# Altium project Gould.PrjPCB (part 1 of 2)
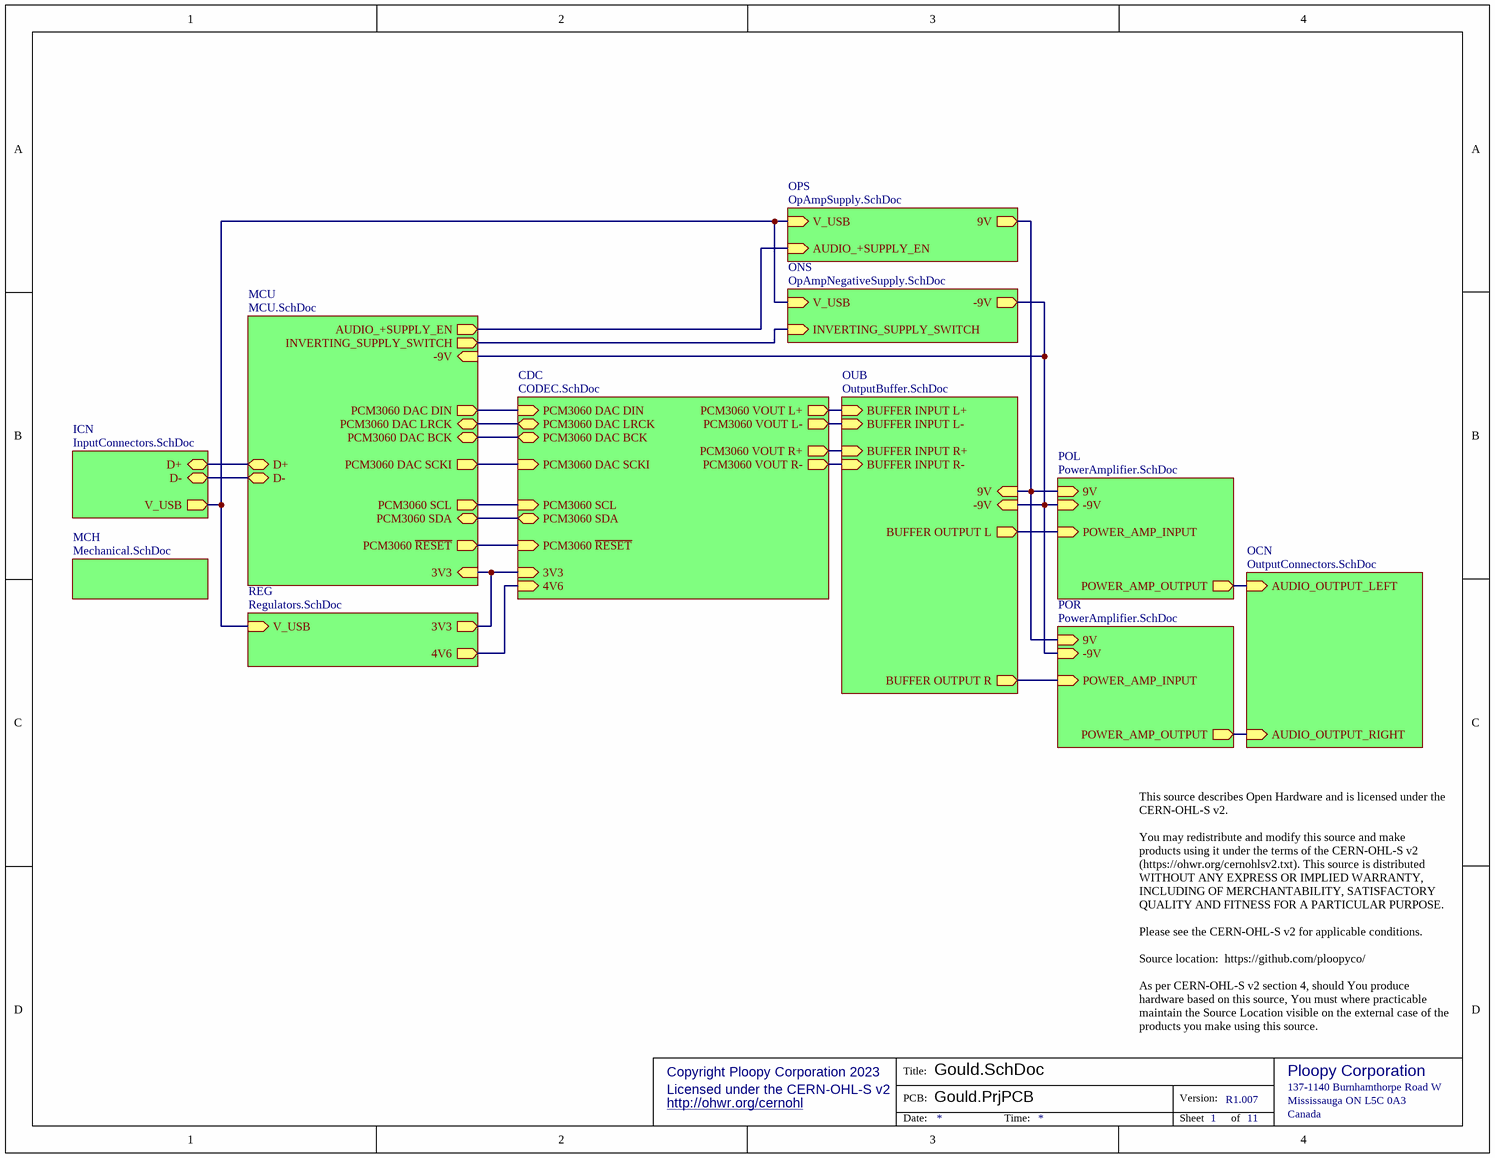
[diagram p0: Gould.SchDoc]
11 sheets, 155 parts. Net scope: hierarchical (ports join the sheet entries above them; power ports are global).
Board file: Gould.PcbDoc
Sheets:
  Gould.SchDoc
    ICN = InputConnectors.SchDoc
    MCH = Mechanical.SchDoc
    OPS = OpAmpSupply.SchDoc
    OCN = OutputConnectors.SchDoc
    POL = PowerAmplifier.SchDoc
    POR = PowerAmplifier.SchDoc
    MCU = MCU.SchDoc
    CDC = CODEC.SchDoc
    REG = Regulators.SchDoc
    OUB = OutputBuffer.SchDoc
    ONS = OpAmpNegativeSupply.SchDoc

## Sheet Gould.SchDoc
size Letter; CompanyName: Ploopy Corporation; Organization: Ploopy Corporation; Address1: Suite 226, 137-1140 Burnhamthorpe Road W; Address2: Mississauga; Address3: Ontario; Address4: Canada L5C 0A3; DocumentNumber: 1; Revision: R1.007; SheetNumber: 1; SheetTotal: 11

### Sub-sheets
CDC = CODEC.SchDoc: PCM3060 DAC DIN (in), PCM3060 SDA (bidir), PCM3060 DAC LRCK (bidir), PCM3060 VOUT L+ (out), PCM3060 VOUT R+ (out), PCM3060 SCL (in), PCM3060 DAC BCK (bidir), PCM3060 ~{RESET} (in), 3V3 (in), 4V6 (in), PCM3060 VOUT L- (out), PCM3060 VOUT R- (out), PCM3060 DAC SCKI (in)
ICN = InputConnectors.SchDoc: V_USB (out), D+ (bidir), D- (bidir)
MCH = Mechanical.SchDoc: no entries
MCU = MCU.SchDoc: D+ (bidir), D- (bidir), 3V3 (in), PCM3060 DAC DIN (out), PCM3060 SDA (bidir), PCM3060 DAC LRCK (bidir), PCM3060 SCL (out), PCM3060 DAC BCK (bidir), PCM3060 ~{RESET} (out), INVERTING_SUPPLY_SWITCH (out), -9V (in), PCM3060 DAC SCKI (out), AUDIO_+SUPPLY_EN (out)
OCN = OutputConnectors.SchDoc: AUDIO_OUTPUT_LEFT (in), AUDIO_OUTPUT_RIGHT (in)
ONS = OpAmpNegativeSupply.SchDoc: V_USB (in), -9V (out), INVERTING_SUPPLY_SWITCH (in)
OPS = OpAmpSupply.SchDoc: V_USB (in), 9V (out), AUDIO_+SUPPLY_EN (in)
OUB = OutputBuffer.SchDoc: -9V (in), 9V (in), BUFFER OUTPUT R (out), BUFFER INPUT R- (in), BUFFER INPUT R+ (in), BUFFER INPUT L- (in), BUFFER OUTPUT L (out), BUFFER INPUT L+ (in)
POL = PowerAmplifier.SchDoc: POWER_AMP_INPUT (in), POWER_AMP_OUTPUT (out), -9V (in), 9V (in)
POR = PowerAmplifier.SchDoc: POWER_AMP_INPUT (in), POWER_AMP_OUTPUT (out), -9V (in), 9V (in)
REG = Regulators.SchDoc: 3V3 (out), V_USB (in), 4V6 (out)

### Nets
3V3: sheet MCU/3V3, sheet CDC/3V3, sheet REG/3V3
4V6: sheet CDC/4V6, sheet REG/4V6
9V: sheet OPS/9V, sheet POL/9V, sheet POR/9V, sheet OUB/9V
-9V: sheet POL/-9V, sheet POR/-9V, sheet MCU/-9V, sheet OUB/-9V, sheet ONS/-9V
NetC3_2: sheet POR/POWER_AMP_INPUT, sheet OUB/BUFFER OUTPUT R
NetC8_2: sheet ICN/V_USB, sheet OPS/V_USB, sheet REG/V_USB, sheet ONS/V_USB
NetC9_2: sheet POL/POWER_AMP_INPUT, sheet OUB/BUFFER OUTPUT L
NetD2_1: sheet OCN/AUDIO_OUTPUT_RIGHT, sheet POR/POWER_AMP_OUTPUT
NetD2_2: sheet OCN/AUDIO_OUTPUT_LEFT, sheet POL/POWER_AMP_OUTPUT
NetFB4_2: sheet ICN/D-, sheet MCU/D-
NetFB5_2: sheet ICN/D+, sheet MCU/D+
NetQ1_G: sheet MCU/INVERTING_SUPPLY_SWITCH, sheet ONS/INVERTING_SUPPLY_SWITCH
NetR1_2: sheet OPS/AUDIO_+SUPPLY_EN, sheet MCU/AUDIO_+SUPPLY_EN
NetRa1_3: sheet MCU/PCM3060 SDA, sheet CDC/PCM3060 SDA
NetRa1_4: sheet MCU/PCM3060 SCL, sheet CDC/PCM3060 SCL
NetRa4_1: sheet CDC/PCM3060 VOUT L+, sheet OUB/BUFFER INPUT L+
NetRa4_2: sheet CDC/PCM3060 VOUT L-, sheet OUB/BUFFER INPUT L-
NetRa4_3: sheet CDC/PCM3060 VOUT R+, sheet OUB/BUFFER INPUT R+
NetRa4_4: sheet CDC/PCM3060 VOUT R-, sheet OUB/BUFFER INPUT R-
NetU10_9: sheet MCU/PCM3060 DAC SCKI, sheet CDC/PCM3060 DAC SCKI
NetU10_10: sheet MCU/PCM3060 DAC BCK, sheet CDC/PCM3060 DAC BCK
NetU10_11: sheet MCU/PCM3060 DAC LRCK, sheet CDC/PCM3060 DAC LRCK
NetU10_12: sheet MCU/PCM3060 DAC DIN, sheet CDC/PCM3060 DAC DIN
NetU10_15: sheet MCU/PCM3060 ~{RESET}, sheet CDC/PCM3060 ~{RESET}

### Notes on the sheet
- This source describes Open Hardware and is licensed under the CERN-OHL-S v2.
  You may redistribute and modify this source and make products using it under the terms of the CERN-OHL-S v2 (https://ohwr.org/cernohlsv2.txt). This source is distributed WITHOUT ANY EXPRESS OR IMPLIED WARRANTY, INCLUDING OF MERCHANTABILITY, SATISFACTORY QUALITY AND FITNESS FOR A PARTICULAR PURPOSE.
  Please see the CERN-OHL-S v2 for applicable conditions.
  Source location:  https://github.com/ploopyco/
  As per CERN-OHL-S v2 section 4, should You produce hardware based on this source, You must where practicable maintain the Source Location visible on the external case of the products you make using this source.
- Copyright Ploopy Corporation 2023
- Licensed under the CERN-OHL-S v2
- http://ohwr.org/cernohl
- Title:
- PCB:
- Version:
- Ploopy Corporation
- Mississauga ON L5C 0A3
- 137-1140 Burnhamthorpe Road W
- Date:
- Time:
- Sheet
- of
- Canada

## Sheet InputConnectors.SchDoc
size Letter; CompanyName: Ploopy Corporation; Organization: Ploopy Corporation; Address1: Suite 226, 137-1140 Burnhamthorpe Road W; Address2: Mississauga; Address3: Ontario; Address4: Canada L5C 0A3; DocumentNumber: 3; Revision: R1.007; SheetNumber: 3; SheetTotal: 11
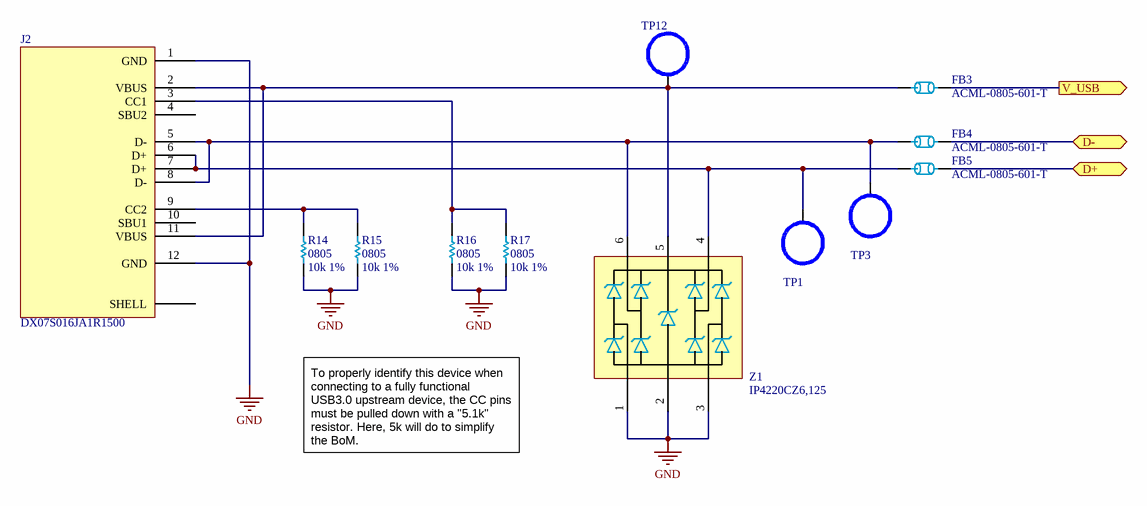
[diagram p1: InputConnectors.SchDoc]

### Parts
FB3  ACML-0805-601-T  [0805]
FB4  ACML-0805-601-T  [0805]
FB5  ACML-0805-601-T  [0805]
J2  DX07S016JA1R1500  [DX07S016JA1R1500]
R14  0805  value 10k 1%  [0805]
R15  0805  value 10k 1%  [0805]
R16  0805  value 10k 1%  [0805]
R17  0805  value 10k 1%  [0805]
TP1  TestPointHook  [S2751-46R]  (value not drawn)
TP3  TestPointHook  [S2751-46R]  (value not drawn)
TP12  TestPointHook  [S2751-46R]  (value not drawn)
Z1  IP4220CZ6,125  [PESD3V3S4UD - SOT95P275X110-6N]

### Ports
D+ (bidir), D- (bidir), V_USB (out)

### Nets
GND: J2.1(GND) J2.12(GND) R14.1 R15.1 R16.1 R17.1 Z1.1 Z1.2 Z1.3
NetC8_2: FB3.2 ; port V_USB
NetFB3_1: FB3.1 J2.2(VBUS) J2.11(VBUS) TP12.1 Z1.5
NetFB4_1: FB4.1 J2.5(D-) J2.8(D-) TP3.1 Z1.6
NetFB4_2: FB4.2 ; port D-
NetFB5_1: FB5.1 J2.6(D+) J2.7(D+) TP1.1 Z1.4
NetFB5_2: FB5.2 ; port D+
NetJ2_3: J2.3(CC1) R16.2 R17.2
NetJ2_9: J2.9(CC2) R14.2 R15.2

Not connected (* = marked no-connect by the designer): J2 4(SBU2) 10(SBU1) SHELL

### Notes on the sheet
- To properly identify this device when connecting to a fully functional USB3.0 upstream device, the CC pins must be pulled down with a "5.1k" resistor. Here, 5k will do to simplify the BoM.
- Copyright Ploopy Corporation 2023
- Licensed under the CERN-OHL-S v2
- http://ohwr.org/cernohl
- Title:
- PCB:
- Version:
- Ploopy Corporation
- Mississauga ON L5C 0A3
- 137-1140 Burnhamthorpe Road W
- Date:
- Time:
- Sheet
- of
- Canada

### Library data of the parts
FB3-FB5 = ACML-0805-601-T: FERRITE BEAD 600 OHM 0805 1LN; PNP-Nzl: 2; PNP-dx: 0; PNP-X: 2.00; PNP-Y: 1.25; PNP-Thk: 0.55; PNP-Lv: 1; PNP-TS: 70; PNP-Type: chi; PNP-FeedType: Tape; PNP-TapeWidth: 8; PNP-dy: 0; PNP-Pt: 0; PNP-W: 0; PNP-Level: 1; PNP-Voff: 0; PNP-PlacePriority: 1; PNP-A: 0; PNP-TapeIndex: 1; PNP-da: 0; Supplier 1: Digi-Key; Supplier Part Number 1: 535-12556-1-ND
J2 = DX07S016JA1R1500: USB-C (USB TYPE-C) USB 2.0 Receptacle Connector 24 (16+8 Dummy) Position Surface Mount, Right Angle; Through Hole; Supplier 1: Digi-Key; Supplier 2: Mouser; Supplier Part Number 1: 670-DX07S016JA1R1500CT-ND; Supplier Part Number 2: 656-DX07S016JA1R1500
R14-R17 = Res 10k 1% 0805: Chip resistor; Supplier 1: Digi-Key; Supplier Part Number 1: RMCF0805FT10K0TR-ND
TP1 TP3 TP12 = TestPointHook: Test point, SMT ring (micro-hook compatible); Supplier 1: Digi-Key; Supplier Part Number 1: 952-2664-6-ND; Supplier 2: Digi-Key; Supplier Part Number 2: A106144DKR-ND; Supplier 3: Arrow; Supplier Part Number 3: z_4zPAhGJpPHHYBcC24zmONEz5elv0VZALWfNkICq0w
Z1 = IP4220CZ6,125: TVS DIODE 5.5V 6TSOP (Low capacitance, USB); PNP-Nzl: 2; PNP-dx: 0; PNP-X: 2.9; PNP-Y: 1.3; PNP-A: 270; PNP-Thk: 1; PNP-Lv: 26; PNP-TS: 90; PNP-Type: CHP; PNP-FeedType: Tape; PNP-TapeWidth: 8; PNP-PlacePriority: 3; PNP-dy: 0; PNP-Pt: 0; PNP-W: 0; PNP-Level: 1; PNP-Voff: 0; PNP-TapeIndex: 1; PNP-da: 0

## Sheet Mechanical.SchDoc
size Letter; CompanyName: Ploopy Corporation; Organization: Ploopy Corporation; Address1: Suite 226, 137-1140 Burnhamthorpe Road W; Address2: Mississauga; Address3: Ontario; Address4: Canada L5C 0A3; DocumentNumber: 5; Revision: R1.007; SheetNumber: 5; SheetTotal: 11
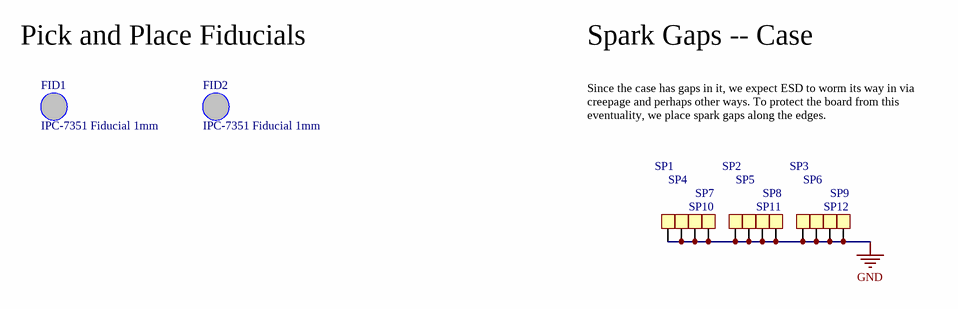
[diagram p2: Mechanical.SchDoc]

### Parts
FID1  IPC-7351 Fiducial 1mm  [FIDUCIAL_1.5]
FID2  IPC-7351 Fiducial 1mm  [FIDUCIAL_1.5]
SP1  Spark Gap  [SparkGap]  (value not drawn)  (no BOM)
SP2  Spark Gap  [SparkGap]  (value not drawn)  (no BOM)
SP3  Spark Gap  [SparkGap]  (value not drawn)  (no BOM)
SP4  Spark Gap  [SparkGap]  (value not drawn)  (no BOM)
SP5  Spark Gap  [SparkGap]  (value not drawn)  (no BOM)
SP6  Spark Gap  [SparkGap]  (value not drawn)  (no BOM)
SP7  Spark Gap  [SparkGap]  (value not drawn)  (no BOM)
SP8  Spark Gap  [SparkGap]  (value not drawn)  (no BOM)
SP9  Spark Gap  [SparkGap]  (value not drawn)  (no BOM)
SP10  Spark Gap  [SparkGap]  (value not drawn)  (no BOM)
SP11  Spark Gap  [SparkGap]  (value not drawn)  (no BOM)
SP12  Spark Gap  [SparkGap]  (value not drawn)  (no BOM)

### Nets
GND: SP1.1 SP2.1 SP3.1 SP4.1 SP5.1 SP6.1 SP7.1 SP8.1 SP9.1 SP10.1 SP11.1 SP12.1

Not connected (* = marked no-connect by the designer): FID1 1; FID2 1

### Notes on the sheet
- Pick and Place Fiducials
- Spark Gaps -- Case
- Since the case has gaps in it, we expect ESD to worm its way in via creepage and perhaps other ways. To protect the board from this eventuality, we place spark gaps along the edges.
- Copyright Ploopy Corporation 2023
- Licensed under the CERN-OHL-S v2
- http://ohwr.org/cernohl
- Title:
- PCB:
- Version:
- Ploopy Corporation
- Mississauga ON L5C 0A3
- 137-1140 Burnhamthorpe Road W
- Date:
- Time:
- Sheet
- of
- Canada

### Library data of the parts
FID1 FID2 = FIDUCIAL_1.5: PNP-Nzl: 2; PNP-dx: 0; PNP-X: 4; PNP-A: 1; PNP-Thk: 1.02; PNP-TS: 70; PNP-Type: MARK1; PNP-dy: 0; PNP-Y: 4; PNP-Pt: 0; PNP-W: 0; PNP-Lv: 1; PNP-Level: 1; PNP-Voff: 0; PNP-FeedType: Fiducial; PNP-TapeWidth: 0; PNP-PlacePriority: 0; PNP-TapeIndex: 0; PNP-da: 0
SP1-SP12 = Spark Gap: Open square pad for spark gapping; PNP-Nzl: 2; PNP-dx: 0; PNP-X: 1; PNP-TS: 70; PNP-Type: CHI; PNP-FeedType: Tape; PNP-TapeWidth: 8; PNP-dy: 0; PNP-Y: 1; PNP-A: 0; PNP-Pt: 0; PNP-W: 0; PNP-Thk: 1; PNP-Lv: 1; PNP-Level: 1; PNP-Voff: 0; PNP-PlacePriority: 1; PNP-TapeIndex: 1; PNP-da: 0

## Sheet OpAmpSupply.SchDoc
size Legal; CompanyName: Ploopy Corporation; Organization: Ploopy Corporation; Address1: Suite 226, 137-1140 Burnhamthorpe Road W; Address2: Mississauga; Address3: Ontario; Address4: Canada L5C 0A3; DocumentNumber: 7; Revision: R1.007; SheetNumber: 7; SheetTotal: 11
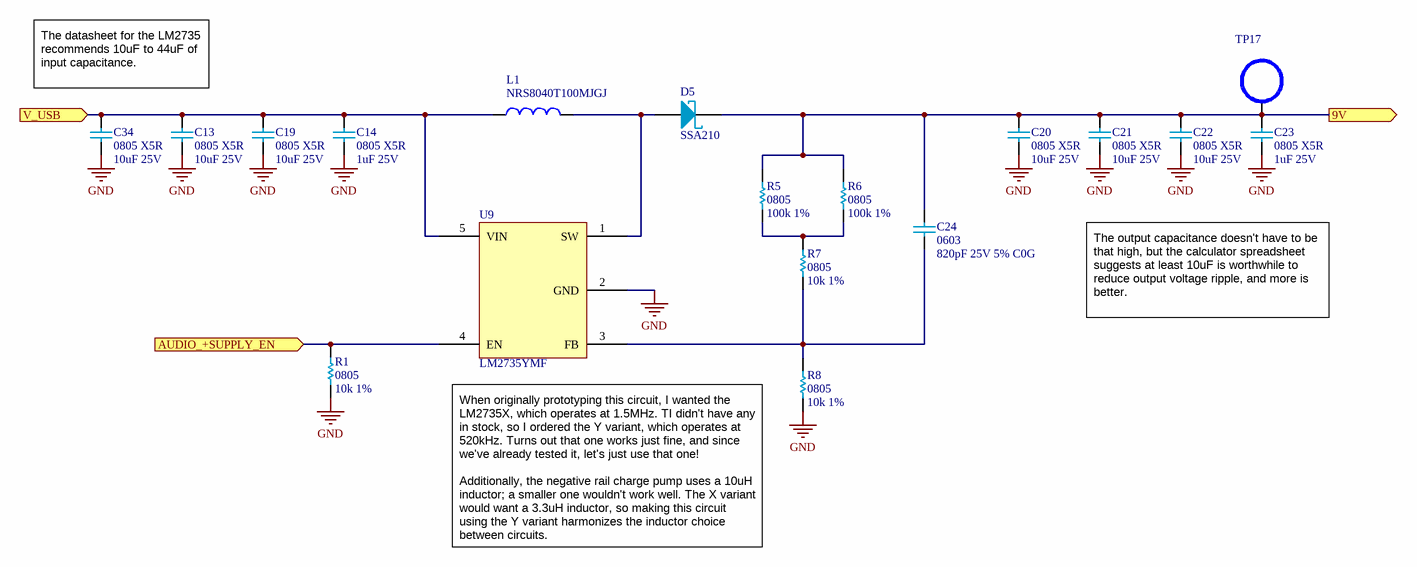
[diagram p3: OpAmpSupply.SchDoc]

### Parts
C13  0805 X5R  value 10uF 25V  [0805 - TALL]
C14  0805 X5R  value 1uF 25V  [0805 - TALL]
C19  0805 X5R  value 10uF 25V  [0805 - TALL]
C20  0805 X5R  value 10uF 25V  [0805 - TALL]
C21  0805 X5R  value 10uF 25V  [0805 - TALL]
C22  0805 X5R  value 10uF 25V  [0805 - TALL]
C23  0805 X5R  value 1uF 25V  [0805 - TALL]
C24  0603  value 820pF 25V 5% C0G  [0603]
C34  0805 X5R  value 10uF 25V  [0805 - TALL]
D5  SSA210  [SSA210 - DO-214AC]
L1  NRS8040T100MJGJ  [NRS8040T100MJGJ]
R1  0805  value 10k 1%  [0805]
R5  0805  value 100k 1%  [0805]
R6  0805  value 100k 1%  [0805]
R7  0805  value 10k 1%  [0805]
R8  0805  value 10k 1%  [0805]
TP17  TestPointHook  [S2751-46R]  (value not drawn)
U9  LM2735YMF  [LM2735XMF - SOT95P280X145-5M]

### Ports
9V (out), AUDIO_+SUPPLY_EN (in), V_USB (in)

### Nets
GND: C13.1 C14.1 C19.1 C20.1 C21.1 C22.1 C23.1 C34.1 R1.1 R8.1 U9.2(GND)
9V: C20.2 C21.2 C22.2 C23.2 C24.2 D5.1(C) R5.2 R6.2 TP17.1 ; port 9V
NetC8_2: C13.2 C14.2 C19.2 C34.2 L1.1 U9.5(VIN) ; port V_USB
NetC24_1: C24.1 R7.1 R8.2 U9.3(FB)
NetD5_2: D5.2 L1.2 U9.1(SW)
NetR1_2: R1.2 U9.4(EN) ; port AUDIO_+SUPPLY_EN
NetR5_1: R5.1 R6.1 R7.2

### Notes on the sheet
- The datasheet for the LM2735 recommends 10uF to 44uF of input capacitance.
- The output capacitance doesn't have to be that high, but the calculator spreadsheet suggests at least 10uF is worthwhile to reduce output voltage ripple, and more is better.
- When originally prototyping this circuit, I wanted the LM2735X, which operates at 1.5MHz. TI didn't have any in stock, so I ordered the Y variant, which operates at 520kHz. Turns out that one works just fine, and since we've already tested it, let's just use that one!
  Additionally, the negative rail charge pump uses a 10uH inductor; a smaller one wouldn't work well. The X variant would want a 3.3uH inductor, so making this circuit using the Y variant harmonizes the inductor choice between circuits.
- Copyright Ploopy Corporation 2023
- Licensed under the CERN-OHL-S v2
- http://ohwr.org/cernohl
- Title:
- PCB:
- Version:
- Ploopy Corporation
- Mississauga ON L5C 0A3
- 137-1140 Burnhamthorpe Road W
- Date:
- Time:
- Sheet
- of
- Canada

### Library data of the parts
C13 C19-C22 C34 = Cap 10uF 25V: 0805, X5R or better; Supplier 1: Mouser; Supplier Part Number 1: 81-GRM21BR61E106KA3L; Supplier 2: Digi-Key; Supplier Part Number 2: 490-5523-1-ND
C14 C23 = Cap 1uF 25V: 0805, X5R or better; Supplier 1: Digi-Key; Supplier Part Number 1: 1276-1066-2-ND; Supplier 2: Digi-Key; Supplier Part Number 2: 1276-1066-1-ND
C24 = Cap 820pF 25V: 0603, 5% C0G or better
D5 = SSA210: 100V 2A Shottky Diode (Rectifier); Supplier 1: Mouser; Supplier Part Number 1: 512-SSA210; Supplier 2: Digi-Key; Supplier Part Number 2: SSA210CT-ND
L1 = NRS8040T100MJGJ: FIXED IND 10UH 3.1A 44.2MOHM SMD
R1 R7 R8 = Res 10k 1% 0805: Chip resistor; Supplier 1: Digi-Key; Supplier Part Number 1: RMCF0805FT10K0TR-ND
R5 R6 = Res 100k 1% 0805: Chip resistor; Supplier 1: Digi-Key; Supplier 2: Digi-Key; Supplier Part Number 1: RMCF0805FT100KTR-ND; Supplier Part Number 2: RMCF0805FT100KCT-ND
TP17 = TestPointHook: as TP1 on sheet InputConnectors; Supplier 1: Digi-Key; Supplier Part Number 1: 952-2664-6-ND; Supplier 2: Digi-Key; Supplier Part Number 2: A106144DKR-ND; Supplier 3: Arrow; Supplier Part Number 3: z_4zPAhGJpPHHYBcC24zmONEz5elv0VZALWfNkICq0w
U9 = LM2735YMF: LM2735 520-kHz Space-Efficient Boost and SEPIC DC/DC Regulator

## Sheet OutputConnectors.SchDoc
size Letter; CompanyName: Ploopy Corporation; Organization: Ploopy Corporation; Address1: Suite 226, 137-1140 Burnhamthorpe Road W; Address2: Mississauga; Address3: Ontario; Address4: Canada L5C 0A3; DocumentNumber: 9; Revision: R1.007; SheetNumber: 9; SheetTotal: 11
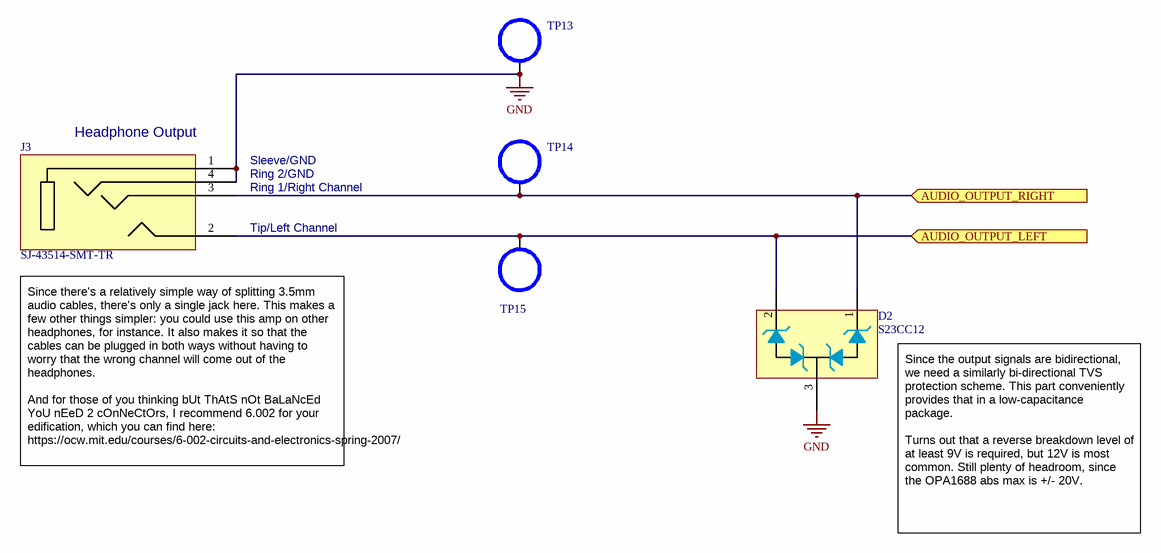
[diagram p4: OutputConnectors.SchDoc]

### Parts
D2  S23CC12  [S23CC12 - SOT90P240X110-3M]
J3  SJ-43514-SMT-TR  [SJ-43514-SMT-TR]
TP13  TestPointHook  [S2751-46R]  (value not drawn)
TP14  TestPointHook  [S2751-46R]  (value not drawn)
TP15  TestPointHook  [S2751-46R]  (value not drawn)

### Ports
AUDIO_OUTPUT_LEFT (in), AUDIO_OUTPUT_RIGHT (in)

### Nets
GND: D2.3 J3.1 J3.4 TP13.1
NetD2_1: D2.1 J3.3 TP14.1 ; port AUDIO_OUTPUT_RIGHT
NetD2_2: D2.2 J3.2 TP15.1 ; port AUDIO_OUTPUT_LEFT

### Notes on the sheet
- (near J3) Headphone Output
- Sleeve/GND
- Ring 2/GND
- Ring 1/Right Channel
- Tip/Left Channel
- (near J3) Since there's a relatively simple way of splitting 3.5mm audio cables, there's only a single jack here. This makes a few other things simpler: you could use this amp on other headphones, for instance. It also makes it so that the cables can be plugged in both ways without having to worry that the wrong channel will come out of the headphones.
  And for those of you thinking bUt ThAtS nOt BaLaNcEd YoU nEeD 2 cOnNeCtOrs, I recommend 6.002 for your edification, which you can find here: https://ocw.mit.edu/courses/6-002-circuits-and-electronics-spring-2007/
- (near D2) Since the output signals are bidirectional, we need a similarly bi-directional TVS protection scheme. This part conveniently provides that in a low-capacitance package.
  Turns out that a reverse breakdown level of at least 9V is required, but 12V is most common. Still plenty of headroom, since the OPA1688 abs max is +/- 20V.
- Copyright Ploopy Corporation 2023
- Licensed under the CERN-OHL-S v2
- http://ohwr.org/cernohl
- Title:
- PCB:
- Version:
- Ploopy Corporation
- Mississauga ON L5C 0A3
- 137-1140 Burnhamthorpe Road W
- Date:
- Time:
- Sheet
- of
- Canada

### Library data of the parts
D2 = S23CC12: 12V 2-CHANNEL LOW CAPACITANCE BI-DIRECTIONAL TVS ARRAY
J3 = SJ-43514-SMT-TR: 3.50mm (0.141", 1/8", Mini Plug) - Headphone Phone Jack Stereo (4 Conductor, TRRS) Connector Solder; Supplier 1: Digi-Key; Supplier 2: Mouser; Supplier Part Number 2: 490-SJ-43514-SMT-TR; Supplier Part Number 1: CP-43514SJCT-ND
TP13-TP15 = TestPointHook: as TP1 on sheet InputConnectors; Supplier 1: Digi-Key; Supplier Part Number 1: 952-2664-6-ND; Supplier 2: Digi-Key; Supplier Part Number 2: A106144DKR-ND; Supplier 3: Arrow; Supplier Part Number 3: z_4zPAhGJpPHHYBcC24zmONEz5elv0VZALWfNkICq0w

## Sheet PowerAmplifier.SchDoc
size Legal; CompanyName: Ploopy Corporation; Organization: Ploopy Corporation; Address1: Suite 226, 137-1140 Burnhamthorpe Road W; Address2: Mississauga; Address3: Ontario; Address4: Canada L5C 0A3; DocumentNumber: 10; Revision: R1.007; SheetNumber: 10; SheetTotal: 11
Used 2 times, as channels POL, POR. Parts and nets are listed once, with the designators drawn on the sheet.
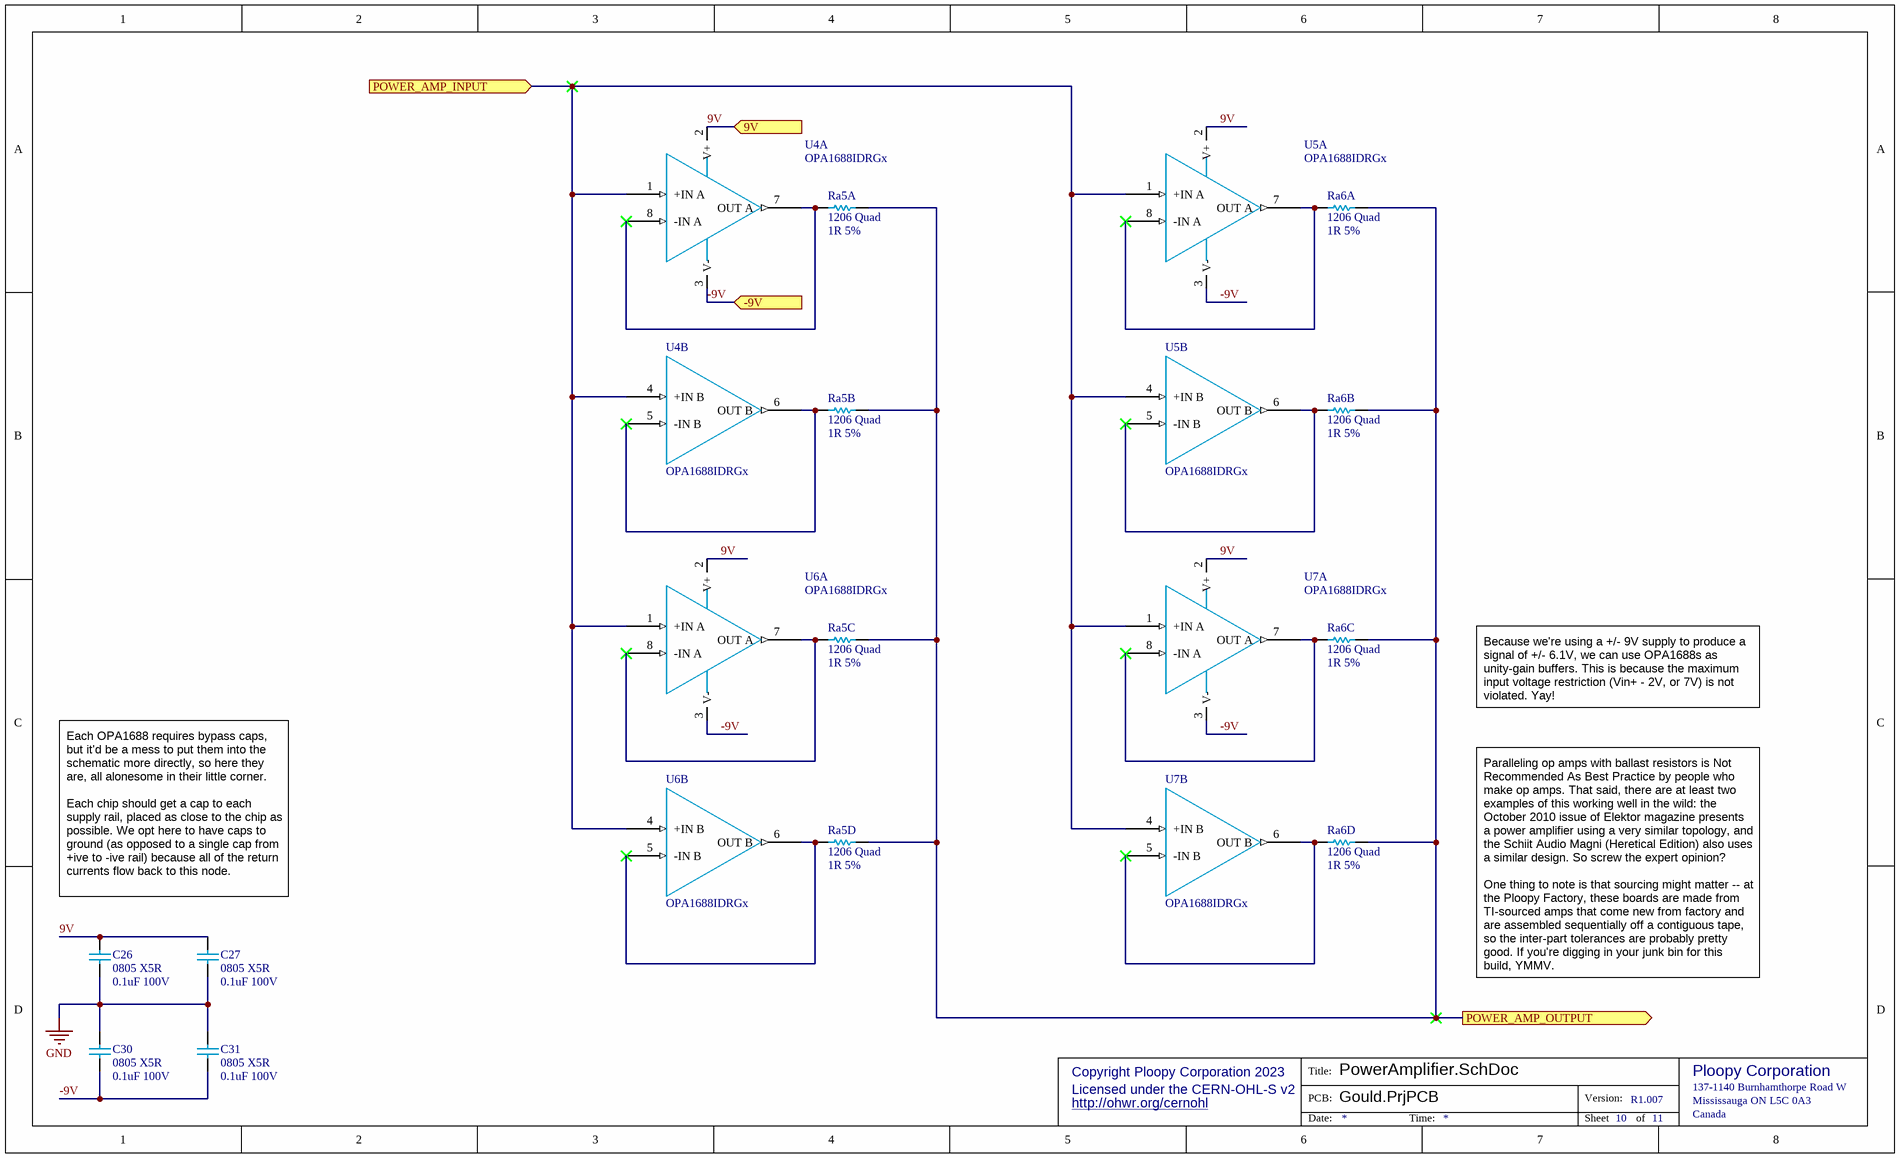
[diagram p5: PowerAmplifier.SchDoc]

### Parts
C26  0805 X5R  value 0.1uF 100V  [0805 - TALL]
C27  0805 X5R  value 0.1uF 100V  [0805 - TALL]
C30  0805 X5R  value 0.1uF 100V  [0805 - TALL]
C31  0805 X5R  value 0.1uF 100V  [0805 - TALL]
Ra5  1206 Quad  value 1R 5%  [4x 1R 5% - CAC-80P320X160-8M]  (parts A,B,C,D of 4)
Ra6  1206 Quad  value 1R 5%  [4x 1R 5% - CAC-80P320X160-8M]  (parts A,B,C,D of 4)
U4  OPA1688IDRGx  [OPA1688 - SON50P300X80_HS-9M]  (parts A,B of 2)
U5  OPA1688IDRGx  [OPA1688 - SON50P300X80_HS-9M]  (parts A,B of 2)
U6  OPA1688IDRGx  [OPA1688 - SON50P300X80_HS-9M]  (parts A,B of 2)
U7  OPA1688IDRGx  [OPA1688 - SON50P300X80_HS-9M]  (parts A,B of 2)

### Ports
9V (in), -9V (in), POWER_AMP_INPUT (in), POWER_AMP_OUTPUT (out)

### Nets
GND: C26.1 C27.1 C30.2 C31.2
9V: C26.2 C27.2 U4.2(V+) U5.2(V+) U6.2(V+) U7.2(V+) ; port 9V
-9V: C30.1 C31.1 U4.3(V-) U5.3(V-) U6.3(V-) U7.3(V-) ; port -9V
POWER_AMP_INPUT: U4.1(+IN_A) U4.4(+IN_B) U5.1(+IN_A) U5.4(+IN_B) U6.1(+IN_A) U6.4(+IN_B) U7.1(+IN_A) U7.4(+IN_B) ; port POWER_AMP_INPUT
POWER_AMP_OUTPUT: Ra5.5 Ra5.6 Ra5.7 Ra5.8 Ra6.5 Ra6.6 Ra6.7 Ra6.8 ; port POWER_AMP_OUTPUT
NetRa5_1: Ra5.1 U4.7(OUT_A) U4.8(-IN_A)
NetRa5_2: Ra5.2 U4.5(-IN_B) U4.6(OUT_B)
NetRa5_3: Ra5.3 U6.7(OUT_A) U6.8(-IN_A)
NetRa5_4: Ra5.4 U6.5(-IN_B) U6.6(OUT_B)
NetRa6_1: Ra6.1 U5.7(OUT_A) U5.8(-IN_A)
NetRa6_2: Ra6.2 U5.5(-IN_B) U5.6(OUT_B)
NetRa6_3: Ra6.3 U7.7(OUT_A) U7.8(-IN_A)
NetRa6_4: Ra6.4 U7.5(-IN_B) U7.6(OUT_B)

### Channels
POL: designators end in _POL; ports 9V=9V -9V=-9V POWER_AMP_INPUT=NetC9_2 POWER_AMP_OUTPUT=NetD2_2
POR: designators end in _POR; ports 9V=9V -9V=-9V POWER_AMP_INPUT=NetC3_2 POWER_AMP_OUTPUT=NetD2_1

### Notes on the sheet
- Because we're using a +/- 9V supply to produce a signal of +/- 6.1V, we can use OPA1688s as unity-gain buffers. This is because the maximum input voltage restriction (Vin+ - 2V, or 7V) is not violated. Yay!
- Each OPA1688 requires bypass caps, but it'd be a mess to put them into the schematic more directly, so here they are, all alonesome in their little corner.
  Each chip should get a cap to each supply rail, placed as close to the chip as possible. We opt here to have caps to ground (as opposed to a single cap from +ive to -ive rail) because all of the return currents flow back to this node.
- Paralleling op amps with ballast resistors is Not Recommended As Best Practice by people who make op amps. That said, there are at least two examples of this working well in the wild: the October 2010 issue of Elektor magazine presents a power amplifier using a very similar topology, and the Schiit Audio Magni (Heretical Edition) also uses a similar design. So screw the expert opinion?
  One thing to note is that sourcing might matter -- at the Ploopy Factory, these boards are made from TI-sourced amps that come new from factory and are assembled sequentially off a contiguous tape, so the inter-part tolerances are probably pretty good. If you're digging in your junk bin for this build, YMMV.
- Copyright Ploopy Corporation 2023
- Licensed under the CERN-OHL-S v2
- http://ohwr.org/cernohl
- Title:
- PCB:
- Version:
- Ploopy Corporation
- Mississauga ON L5C 0A3
- 137-1140 Burnhamthorpe Road W
- Date:
- Time:
- Sheet
- of
- Canada

### Library data of the parts
C26 C27 C30 C31 = Cap 0.1uF 100V: 0805, X5R or better; Supplier 1: Digi-Key; Supplier Part Number 1: 1276-6840-2-ND
Ra5 Ra6 = Quad Res 1R 5% 1206: Chip resistor
U4-U7 = OPA1688IDRGx: 36V, 10MHz, Low Distortion High Drive Rail-to-Rail Output Audio Operational Amplifiers; Supplier 1: Arrow Electronics; Supplier 2: Mouser; Supplier Part Number 2: 595-OPA1688IDRGR; Supplier Part Number 1: OPA1688IDRGR

## Sheet MCU.SchDoc
size Tabloid; CompanyName: Ploopy Corporation; Organization: Ploopy Corporation; Address1: Suite 226, 137-1140 Burnhamthorpe Road W; Address2: Mississauga; Address3: Ontario; Address4: Canada L5C 0A3; DocumentNumber: 4; Revision: R1.007; SheetNumber: 4; SheetTotal: 11
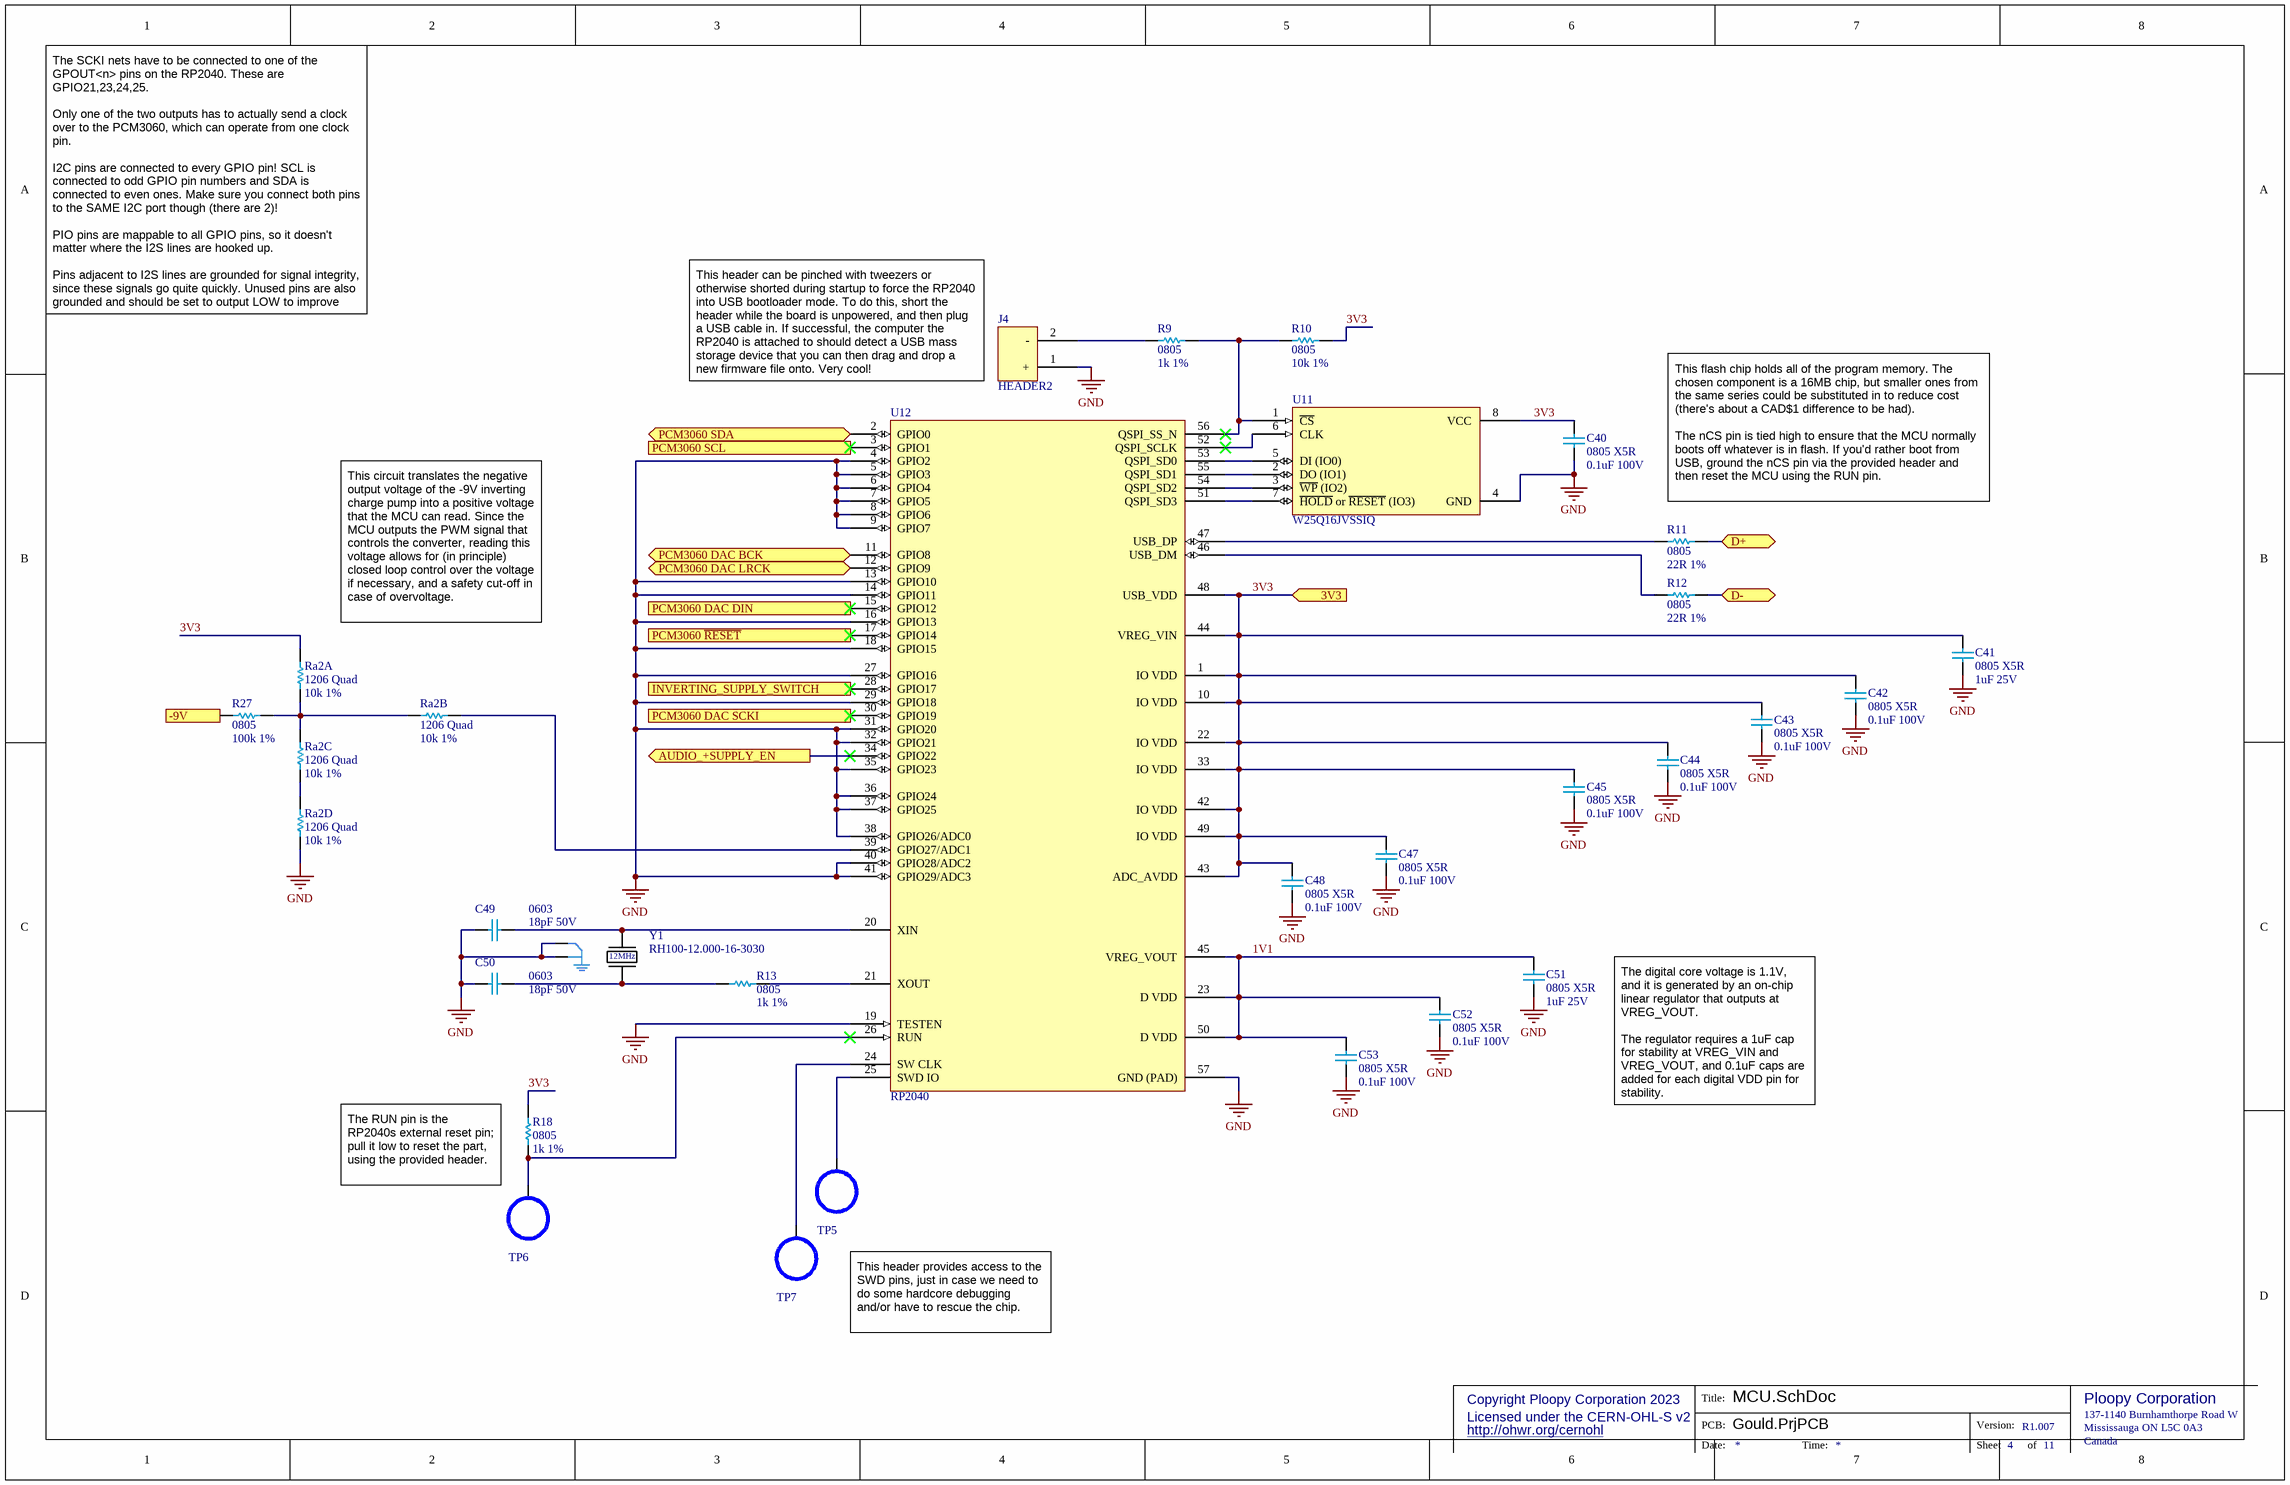
[diagram p6: MCU.SchDoc]

### Parts
C40  0805 X5R  value 0.1uF 100V  [0805 - TALL]
C41  0805 X5R  value 1uF 25V  [0805 - TALL]
C42  0805 X5R  value 0.1uF 100V  [0805 - TALL]
C43  0805 X5R  value 0.1uF 100V  [0805 - TALL]
C44  0805 X5R  value 0.1uF 100V  [0805 - TALL]
C45  0805 X5R  value 0.1uF 100V  [0805 - TALL]
C47  0805 X5R  value 0.1uF 100V  [0805 - TALL]
C48  0805 X5R  value 0.1uF 100V  [0805 - TALL]
C49  0603  value 18pF 50V  [0603]
C50  0603  value 18pF 50V  [0603]
C51  0805 X5R  value 1uF 25V  [0805 - TALL]
C52  0805 X5R  value 0.1uF 100V  [0805 - TALL]
C53  0805 X5R  value 0.1uF 100V  [0805 - TALL]
J4  HEADER2  [2x1]
R9  0805  value 1k 1%  [0805]
R10  0805  value 10k 1%  [0805]
R11  0805  value 22R 1%  [0805]
R12  0805  value 22R 1%  [0805]
R13  0805  value 1k 1%  [0805]
R18  0805  value 1k 1%  [0805]
R27  0805  value 100k 1%  [0805]
Ra2  1206 Quad  value 10k 1%  [4x 10k 1% - CAC-80P320X160-8M]  (parts A,B,C,D of 4)
TP5  TestPointHook  [S2751-46R]  (value not drawn)
TP6  TestPointHook  [S2751-46R]  (value not drawn)
TP7  TestPointHook  [S2751-46R]  (value not drawn)
U11  W25Q16JVSSIQ  [W25Q128JVS - SOIC127P790X216-8M]
U12  RP2040  [RP2040 - QFN40P700X700X90_HS-57M]
Y1  RH100-12.000-16-3030  [RH100-12.000-16-3030]

### Ports
3V3 (in), -9V (in), AUDIO_+SUPPLY_EN (out), D+ (bidir), D- (bidir), INVERTING_SUPPLY_SWITCH (out), PCM3060 DAC BCK (bidir), PCM3060 DAC DIN (out), PCM3060 DAC LRCK (bidir), PCM3060 DAC SCKI (out), PCM3060 SCL (out), PCM3060 SDA (bidir), PCM3060 ~{RESET} (out)

### Nets
GND: C40.1 C41.1 C42.1 C43.1 C44.1 C45.1 C47.1 C48.1 C49.2 C50.1 C51.1 C52.1 C53.1 J4.1(+) Ra2.5 U11.4(GND) U12.4(GPIO2) U12.5(GPIO3) U12.6(GPIO4) U12.7(GPIO5) U12.8(GPIO6) U12.9(GPIO7) U12.13(GPIO10) U12.14(GPIO11) U12.16(GPIO13) U12.18(GPIO15) U12.19(TESTEN) U12.27(GPIO16) U12.29(GPIO18) U12.31(GPIO20) U12.32(GPIO21) U12.35(GPIO23) U12.36(GPIO24) U12.37(GPIO25) U12.38(GPIO26/ADC0) U12.40(GPIO28/ADC2) U12.41(GPIO29/ADC3) U12.57(GND_(PAD)) Y1.2 Y1.4
1V1: C51.2 C52.2 C53.2 U12.23(D_VDD) U12.45(VREG_VOUT) U12.50(D_VDD)
3V3: C40.2 C41.2 C42.2 C43.2 C44.2 C45.2 C47.2 C48.2 R10.1 R18.1 Ra2.1 U11.8(VCC) U12.1(IO_VDD) U12.10(IO_VDD) U12.22(IO_VDD) U12.33(IO_VDD) U12.42(IO_VDD) U12.43(ADC_AVDD) U12.44(VREG_VIN) U12.48(USB_VDD) U12.49(IO_VDD) ; port 3V3
-9V: R27.1 ; port -9V
NetC49_1: C49.1 U12.20(XIN) Y1.1
NetC50_2: C50.2 R13.2 Y1.3
NetFB4_2: R12.2 ; port D-
NetFB5_2: R11.2 ; port D+
NetJ4_2: J4.2(-) R9.1
NetQ1_G: U12.28(GPIO17) ; port INVERTING_SUPPLY_SWITCH
NetR1_2: U12.34(GPIO22) ; port AUDIO_+SUPPLY_EN
NetR9_2: R9.2 R10.2 U11.1(~{CS}) U12.56(QSPI_SS_N)
NetR11_1: R11.1 U12.47(USB_DP)
NetR12_1: R12.1 U12.46(USB_DM)
NetR13_1: R13.1 U12.21(XOUT)
NetR18_2: R18.2 TP6.1 U12.26(RUN)
NetR27_2: R27.2 Ra2.6 Ra2.7 Ra2.8
NetRa1_3: U12.2(GPIO0) ; port PCM3060 SDA
NetRa1_4: U12.3(GPIO1) ; port PCM3060 SCL
NetRa2_2: Ra2.2 U12.39(GPIO27/ADC1)
NetRa2_3: Ra2.3 Ra2.4
NetTP5_1: TP5.1 U12.25(SWD_IO)
NetTP7_1: TP7.1 U12.24(SW_CLK)
NetU10_9: U12.30(GPIO19) ; port PCM3060 DAC SCKI
NetU10_10: U12.11(GPIO8) ; port PCM3060 DAC BCK
NetU10_11: U12.12(GPIO9) ; port PCM3060 DAC LRCK
NetU10_12: U12.15(GPIO12) ; port PCM3060 DAC DIN
NetU10_15: U12.17(GPIO14) ; port PCM3060 ~{RESET}
NetU11_2: U11.2(DO_(IO1)) U12.55(QSPI_SD1)
NetU11_3: U11.3(~{WP}_(IO2)) U12.54(QSPI_SD2)
NetU11_5: U11.5(DI_(IO0)) U12.53(QSPI_SD0)
NetU11_6: U11.6(CLK) U12.52(QSPI_SCLK)
NetU11_7: U11.7(~{HOLD}_or_~{RESET}_(IO3)) U12.51(QSPI_SD3)

### Notes on the sheet
- The SCKI nets have to be connected to one of the GPOUT<n> pins on the RP2040. These are GPIO21,23,24,25.
  Only one of the two outputs has to actually send a clock over to the PCM3060, which can operate from one clock pin.
  I2C pins are connected to every GPIO pin! SCL is connected to odd GPIO pin numbers and SDA is connected to even ones. Make sure you connect both pins to the SAME I2C port though (there are 2)!
  PIO pins are mappable to all GPIO pins, so it doesn't matter where the I2S lines are hooked up.
  Pins adjacent to I2S lines are grounded for signal integrity, since these signals go quite quickly. Unused pins are also grounded and should be set to output LOW to improve grounding.
- This header can be pinched with tweezers or otherwise shorted during startup to force the RP2040 into USB bootloader mode. To do this, short the header while the board is unpowered, and then plug a USB cable in. If successful, the computer the RP2040 is attached to should detect a USB mass storage device that you can then drag and drop a new firmware file onto. Very cool!
- (near R11) This flash chip holds all of the program memory. The chosen component is a 16MB chip, but smaller ones from the same series could be substituted in to reduce cost (there's about a CAD$1 difference to be had).
  The nCS pin is tied high to ensure that the MCU normally boots off whatever is in flash. If you'd rather boot from USB, ground the nCS pin via the provided header and then reset the MCU using the RUN pin.
- This circuit translates the negative output voltage of the -9V inverting charge pump into a positive voltage that the MCU can read. Since the MCU outputs the PWM signal that controls the converter, reading this voltage allows for (in principle) closed loop control over the voltage if necessary, and a safety cut-off in case of overvoltage.
- The digital core voltage is 1.1V, and it is generated by an on-chip linear regulator that outputs at VREG_VOUT.
  The regulator requires a 1uF cap for stability at VREG_VIN and VREG_VOUT, and 0.1uF caps are added for each digital VDD pin for stability.
- The RUN pin is the RP2040s external reset pin; pull it low to reset the part, using the provided header.
- This header provides access to the SWD pins, just in case we need to do some hardcore debugging and/or have to rescue the chip.
- Copyright Ploopy Corporation 2023
- Licensed under the CERN-OHL-S v2
- http://ohwr.org/cernohl
- Title:
- PCB:
- Version:
- Ploopy Corporation
- Mississauga ON L5C 0A3
- 137-1140 Burnhamthorpe Road W
- Date:
- Time:
- Sheet
- of
- Canada
- (in symbol RH100-12.000-16-3030) 12MHz

### Library data of the parts
C40 C42-C45 C47 C48 C52 C53 = Cap 0.1uF 100V: 0805, X5R or better; Supplier 1: Digi-Key; Supplier Part Number 1: 1276-6840-2-ND
C41 C51 = Cap 1uF 25V: 0805, X5R or better; Supplier 1: Digi-Key; Supplier Part Number 1: 1276-1066-2-ND; Supplier 2: Digi-Key; Supplier Part Number 2: 1276-1066-1-ND
C49 C50 = Cap 18pF 50V: 0603, C0G or better; Supplier 1: Digi-Key; Supplier Part Number 1: 1292-1494-1-ND
J4 = HEADER2: 2-pin 0.100" header; Supplier 1: Mouser; Supplier Part Number 1: 855-M20-9990245; Supplier 2: Digi-Key; Supplier Part Number 2: 952-2261-ND
R9 R13 R18 = Res 1k 1% 0805: Chip resistor, 1/8W 100PPM; Supplier 1: Digi-Key; Supplier Part Number 1: RMCF0805FT1K00TR-ND
R10 = Res 10k 1% 0805: Chip resistor; Supplier 1: Digi-Key; Supplier Part Number 1: RMCF0805FT10K0TR-ND
R11 R12 = Res 22R 1% 0805: Chip resistor; Supplier 1: Digi-Key; Supplier 2: Arrow; Supplier Part Number 1: RMCF0805FT22R0CT-ND; Supplier Part Number 2: RMCF0805FT22R0
R27 = Res 100k 1% 0805: Chip resistor; Supplier 1: Digi-Key; Supplier 2: Digi-Key; Supplier Part Number 1: RMCF0805FT100KTR-ND; Supplier Part Number 2: RMCF0805FT100KCT-ND
Ra2 = Quad Res 10k 1% 1206: Chip resistor
TP5-TP7 = TestPointHook: as TP1 on sheet InputConnectors; Supplier 1: Digi-Key; Supplier Part Number 1: 952-2664-6-ND; Supplier 2: Digi-Key; Supplier Part Number 2: A106144DKR-ND; Supplier 3: Arrow; Supplier Part Number 3: z_4zPAhGJpPHHYBcC24zmONEz5elv0VZALWfNkICq0w
Y1 = RH100-12.000-16-3030: 12MHz Crystal 16pF 100 Ohms 4-SMD, No Lead (3.2mm x 2.5mm); Supplier 1: Digi-Key; Supplier 2: Mouser; Supplier Part Number 1: XC2686CT-ND; Supplier Part Number 2: 520-160-12-30B-AGMT
U11 = W25Q16JVSSIQ: Supplier 1: Digi-Key; Supplier Part Number 1: W25Q16JVSSIQ-ND
U12 = RP2040: Supplier 1: Newark; Supplier Part Number 1: 49AJ8740

## Sheet CODEC.SchDoc
size Letter; CompanyName: Ploopy Corporation; Organization: Ploopy Corporation; Address1: Suite 226, 137-1140 Burnhamthorpe Road W; Address2: Mississauga; Address3: Ontario; Address4: Canada L5C 0A3; DocumentNumber: 2; Revision: R1.007; SheetNumber: 2; SheetTotal: 11
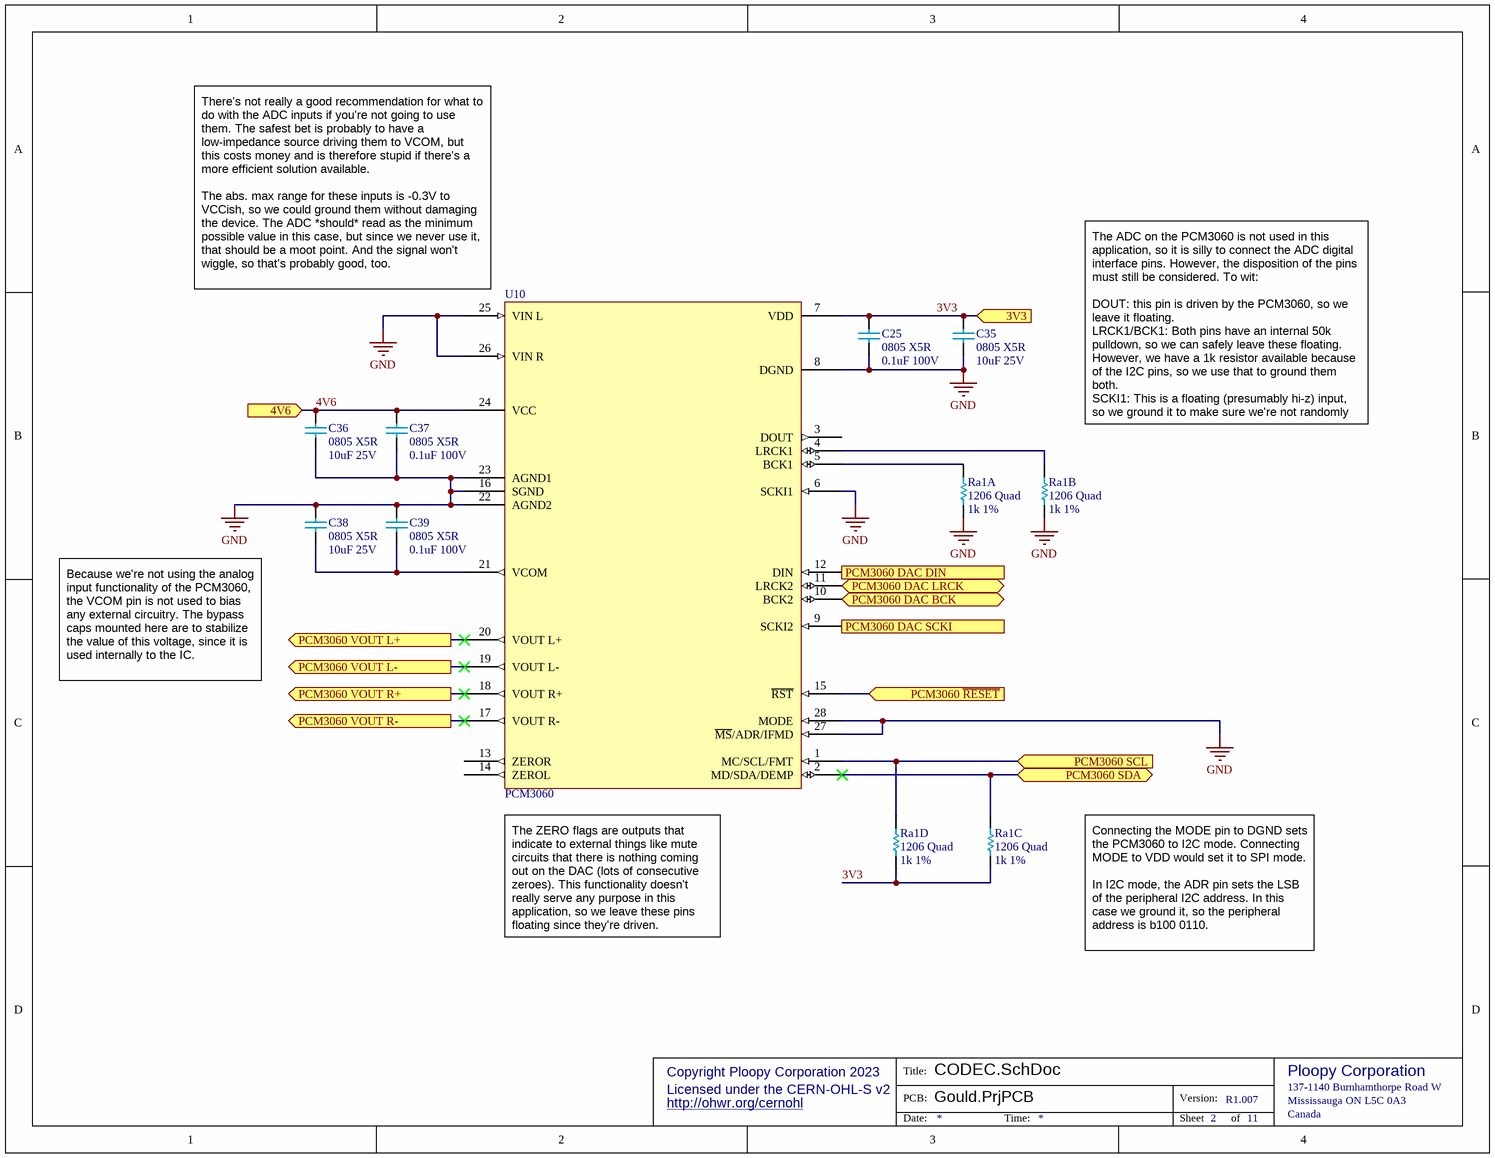
[diagram p7: CODEC.SchDoc]

### Parts
C25  0805 X5R  value 0.1uF 100V  [0805 - TALL]
C35  0805 X5R  value 10uF 25V  [0805 - TALL]
C36  0805 X5R  value 10uF 25V  [0805 - TALL]
C37  0805 X5R  value 0.1uF 100V  [0805 - TALL]
C38  0805 X5R  value 10uF 25V  [0805 - TALL]
C39  0805 X5R  value 0.1uF 100V  [0805 - TALL]
Ra1  1206 Quad  value 1k 1%  [4x 1k 1% - CAC-80P320X160-8M]  (parts A,B,C,D of 4)
U10  PCM3060  [PCM3060 - TSOP65P640X120-28M]

### Ports
3V3 (in), 4V6 (in), PCM3060 DAC BCK (bidir), PCM3060 DAC DIN (in), PCM3060 DAC LRCK (bidir), PCM3060 DAC SCKI (in), PCM3060 SCL (in), PCM3060 SDA (bidir), PCM3060 VOUT L+ (out), PCM3060 VOUT L- (out), PCM3060 VOUT R+ (out), PCM3060 VOUT R- (out), PCM3060 ~{RESET} (in)

### Nets
GND: C25.1 C35.1 C36.1 C37.1 C38.2 C39.2 Ra1.7 Ra1.8 U10.6(SCKI1) U10.8(DGND) U10.16(SGND) U10.22(AGND2) U10.23(AGND1) U10.25(VIN_L) U10.26(VIN_R) U10.27(~{MS}/ADR/IFMD) U10.28(MODE)
3V3: C25.2 C35.2 Ra1.5 Ra1.6 U10.7(VDD) ; port 3V3
4V6: C36.2 C37.2 U10.24(VCC) ; port 4V6
NetC38_1: C38.1 C39.1 U10.21(VCOM)
NetRa1_1: Ra1.1 U10.5(BCK1)
NetRa1_2: Ra1.2 U10.4(LRCK1)
NetRa1_3: Ra1.3 U10.2(MD/SDA/DEMP) ; port PCM3060 SDA
NetRa1_4: Ra1.4 U10.1(MC/SCL/FMT) ; port PCM3060 SCL
NetRa4_1: U10.20(VOUT_L+) ; port PCM3060 VOUT L+
NetRa4_2: U10.19(VOUT_L-) ; port PCM3060 VOUT L-
NetRa4_3: U10.18(VOUT_R+) ; port PCM3060 VOUT R+
NetRa4_4: U10.17(VOUT_R-) ; port PCM3060 VOUT R-
NetU10_9: U10.9(SCKI2) ; port PCM3060 DAC SCKI
NetU10_10: U10.10(BCK2) ; port PCM3060 DAC BCK
NetU10_11: U10.11(LRCK2) ; port PCM3060 DAC LRCK
NetU10_12: U10.12(DIN) ; port PCM3060 DAC DIN
NetU10_15: U10.15(~{RST}) ; port PCM3060 ~{RESET}

Not connected (* = marked no-connect by the designer): U10 3(DOUT) 13(ZEROR) 14(ZEROL)

### Notes on the sheet
- (near U10) There's not really a good recommendation for what to do with the ADC inputs if you're not going to use them. The safest bet is probably to have a low-impedance source driving them to VCOM, but this costs money and is therefore stupid if there's a more efficient solution available.
  The abs. max range for these inputs is -0.3V to VCCish, so we could ground them without damaging the device. The ADC *should* read as the minimum possible value in this case, but since we never use it, that should be a moot point. And the signal won't wiggle, so that's probably good, too.
- The ADC on the PCM3060 is not used in this application, so it is silly to connect the ADC digital interface pins. However, the disposition of the pins must still be considered. To wit:
  DOUT: this pin is driven by the PCM3060, so we leave it floating.
  LRCK1/BCK1: Both pins have an internal 50k pulldown, so we can safely leave these floating. However, we have a 1k resistor available because of the I2C pins, so we use that to ground them both.
  SCKI1: This is a floating (presumably hi-z) input, so we ground it to make sure we're not randomly clocking the ADC interface.
- Because we're not using the analog input functionality of the PCM3060, the VCOM pin is not used to bias any external circuitry. The bypass caps mounted here are to stabilize the value of this voltage, since it is used internally to the IC.
- (near U10) The ZERO flags are outputs that indicate to external things like mute circuits that there is nothing coming out on the DAC (lots of consecutive zeroes). This functionality doesn't really serve any purpose in this application, so we leave these pins floating since they're driven.
- Connecting the MODE pin to DGND sets the PCM3060 to I2C mode. Connecting MODE to VDD would set it to SPI mode.
  In I2C mode, the ADR pin sets the LSB of the peripheral I2C address. In this case we ground it, so the peripheral address is b100 0110.
- Copyright Ploopy Corporation 2023
- Licensed under the CERN-OHL-S v2
- http://ohwr.org/cernohl
- Title:
- PCB:
- Version:
- Ploopy Corporation
- Mississauga ON L5C 0A3
- 137-1140 Burnhamthorpe Road W
- Date:
- Time:
- Sheet
- of
- Canada

### Library data of the parts
C25 C37 C39 = Cap 0.1uF 100V: 0805, X5R or better; Supplier 1: Digi-Key; Supplier Part Number 1: 1276-6840-2-ND
C35 C36 C38 = Cap 10uF 25V: 0805, X5R or better; Supplier 1: Mouser; Supplier Part Number 1: 81-GRM21BR61E106KA3L; Supplier 2: Digi-Key; Supplier Part Number 2: 490-5523-1-ND
Ra1 = Quad Res 1k 1% 1206: Chip resistor
U10 = PCM3060: 24-BIT, 96/192-kHz ASYNCHRONOUS STEREO AUDIO CODEC

## Sheet Regulators.SchDoc
size Letter; CompanyName: Ploopy Corporation; Organization: Ploopy Corporation; Address1: Suite 226, 137-1140 Burnhamthorpe Road W; Address2: Mississauga; Address3: Ontario; Address4: Canada L5C 0A3; DocumentNumber: 11; Revision: R1.007; SheetNumber: 11; SheetTotal: 11
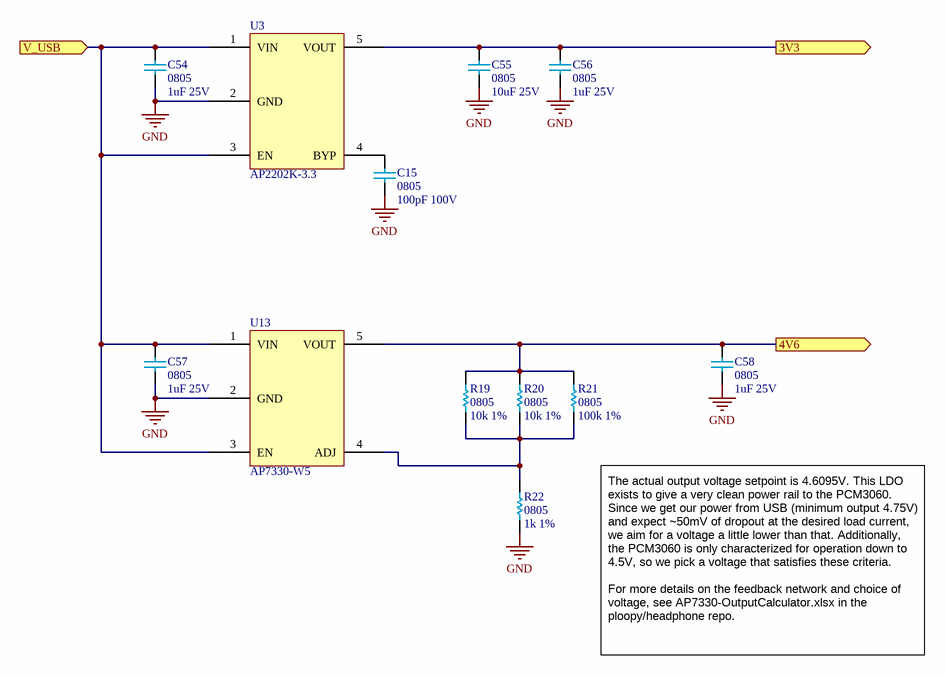
[diagram p8: Regulators.SchDoc]

### Parts
C15  0805  value 100pF 100V  [0805]
C54  0805  value 1uF 25V  [0805]
C55  0805  value 10uF 25V  [0805]
C56  0805  value 1uF 25V  [0805]
C57  0805  value 1uF 25V  [0805]
C58  0805  value 1uF 25V  [0805]
R19  0805  value 10k 1%  [0805]
R20  0805  value 10k 1%  [0805]
R21  0805  value 100k 1%  [0805]
R22  0805  value 1k 1%  [0805]
U3  AP2202K-3.3  [AP2202 - SOT95P270X145-5N]
U13  AP7330-W5  [AP7330-W5 - SOT95P270X145-5N]

### Ports
3V3 (out), 4V6 (out), V_USB (in)

### Nets
GND: C15.1 C54.1 C55.1 C56.1 C57.1 C58.1 R22.1 U3.2(GND) U13.2(GND)
3V3: C55.2 C56.2 U3.5(VOUT) ; port 3V3
4V6: C58.2 R19.2 R20.2 R21.2 U13.5(VOUT) ; port 4V6
NetC8_2: C54.2 C57.2 U3.1(VIN) U3.3(EN) U13.1(VIN) U13.3(EN) ; port V_USB
NetC15_2: C15.2 U3.4(BYP)
NetR19_1: R19.1 R20.1 R21.1 R22.2 U13.4(ADJ)

### Notes on the sheet
- The actual output voltage setpoint is 4.6095V. This LDO exists to give a very clean power rail to the PCM3060. Since we get our power from USB (minimum output 4.75V) and expect ~50mV of dropout at the desired load current, we aim for a voltage a little lower than that. Additionally, the PCM3060 is only characterized for operation down to 4.5V, so we pick a voltage that satisfies these criteria.
  For more details on the feedback network and choice of voltage, see AP7330-OutputCalculator.xlsx in the ploopy/headphone repo.
- Copyright Ploopy Corporation 2023
- Licensed under the CERN-OHL-S v2
- http://ohwr.org/cernohl
- Title:
- PCB:
- Version:
- Ploopy Corporation
- Mississauga ON L5C 0A3
- 137-1140 Burnhamthorpe Road W
- Date:
- Time:
- Sheet
- of
- Canada

### Library data of the parts
C15 = Cap 100pF 100V: 0805, X5R or better; PNP-Nzl: 2; PNP-dx: 0; PNP-X: 2.00; PNP-Y: 1.25; PNP-Thk: 0.60; PNP-Lv: 1; PNP-TS: 70; PNP-Type: chi; PNP-FeedType: Tape; PNP-TapeWidth: 8; Supplier 1: Digi-Key; Supplier Part Number 1: 1276-2426-1-ND; Supplier 2: Digi-Key; Supplier Part Number 2: 1276-2426-2-ND; PNP-dy: 0; PNP-Pt: 0; PNP-W: 0; PNP-Level: 1; PNP-Voff: 0; PNP-PlacePriority: 1; PNP-A: 0; PNP-TapeIndex: 1; Supplier 3: Arrow; Supplier Part Number 3: L5XIfgkrxsBQF2sGZ85JNyFE59-nywaq7sHwLppiklbTEIlO4Ffw3x4_A6bjf4Mm; PNP-da: 0
C54 C56-C58 = Cap 1uF 25V: 0805, X5R or better; PNP-Nzl: 2; PNP-dx: 0; PNP-Level: 1; PNP-Thk: 1.25; PNP-TS: 70; PNP-Type: chi; PNP-X: 2.00; PNP-FeedType: Tape; PNP-TapeWidth: 8; Supplier 1: Digi-Key; Supplier Part Number 1: 1276-1066-2-ND; Supplier 2: Digi-Key; Supplier Part Number 2: 1276-1066-1-ND; PNP-dy: 0; PNP-Lv: 1; PNP-Pt: 0; PNP-Voff: 0; PNP-W: 0; PNP-Y: 1.25; PNP-A: 0; PNP-PlacePriority: 1; PNP-TapeIndex: 1; PNP-da: 0
C55 = Cap 10uF 25V: 0805, X5R or better; PNP-Nzl: 2; PNP-dx: 0; PNP-X: 2.00; PNP-Y: 1.25; PNP-Lv: 1; PNP-TS: 70; PNP-Type: chi; PNP-FeedType: Tape; PNP-TapeWidth: 8; PNP-dy: 0; PNP-Pt: 0; PNP-W: 0; PNP-Thk: 1.25; PNP-Level: 1; PNP-Voff: 0; PNP-PlacePriority: 1; PNP-A: 0; PNP-TapeIndex: 1; Supplier 1: Mouser; Supplier Part Number 1: 81-GRM21BR61E106KA3L; Supplier 2: Digi-Key; Supplier Part Number 2: 490-5523-1-ND; PNP-da: 0
R19 R20 = Res 10k 1% 0805: Chip resistor; Supplier 1: Digi-Key; Supplier Part Number 1: RMCF0805FT10K0TR-ND
R21 = Res 100k 1% 0805: Chip resistor; Supplier 1: Digi-Key; Supplier 2: Digi-Key; Supplier Part Number 1: RMCF0805FT100KTR-ND; Supplier Part Number 2: RMCF0805FT100KCT-ND
R22 = Res 1k 1% 0805: Chip resistor, 1/8W 100PPM; Supplier 1: Digi-Key; Supplier Part Number 1: RMCF0805FT1K00TR-ND
U3 = AP2202K-3.3: 3.3V 150mA LDO regulator; PNP-Nzl: 2; PNP-dx: 0; PNP-X: 2.9; PNP-Y: 1.3; PNP-A: 90; PNP-Thk: 1; PNP-Lv: 26; PNP-Type: CHP; PNP-FeedType: Tape; PNP-TapeWidth: 8; PNP-PlacePriority: 3; PNP-dy: 0; PNP-Pt: 0; PNP-W: 0; PNP-TS: 90; PNP-Level: 1; PNP-Voff: 0; PNP-TapeIndex: 1; Supplier 1: Mouser; Supplier Part Number 1: 621-AP2202K-3.3TRG1; Supplier 2: Digi-Key; Supplier Part Number 2: AP2202K-3.3TRG1DICT-ND; Supplier 3: Arrow; Supplier Part Number 3: PWagzdsTFFHKE_U17B45SP-NtndBrheJIaI5hB7gHD0ZVywxIBNyoAQstvnyfZZ0; PNP-da: 0
U13 = AP7330-W5: 300mA HIGH PSRR LOW NOISE LDO WITH ENABLE; Supplier 1: Digi-Key; Supplier Part Number 1: AP2202K-ADJTRG1DICT-ND; Supplier 2: Digi-Key; Supplier Part Number 2: 576-1262-1-ND

## Sheet OutputBuffer.SchDoc
size Letter; CompanyName: Ploopy Corporation; Organization: Ploopy Corporation; Address1: Suite 226, 137-1140 Burnhamthorpe Road W; Address2: Mississauga; Address3: Ontario; Address4: Canada L5C 0A3; DocumentNumber: 8; Revision: R1.007; SheetNumber: 8; SheetTotal: 11; SPICEModelCache: <root> / <DocumentId>SDQUHXFI</DocumentId> / </root>
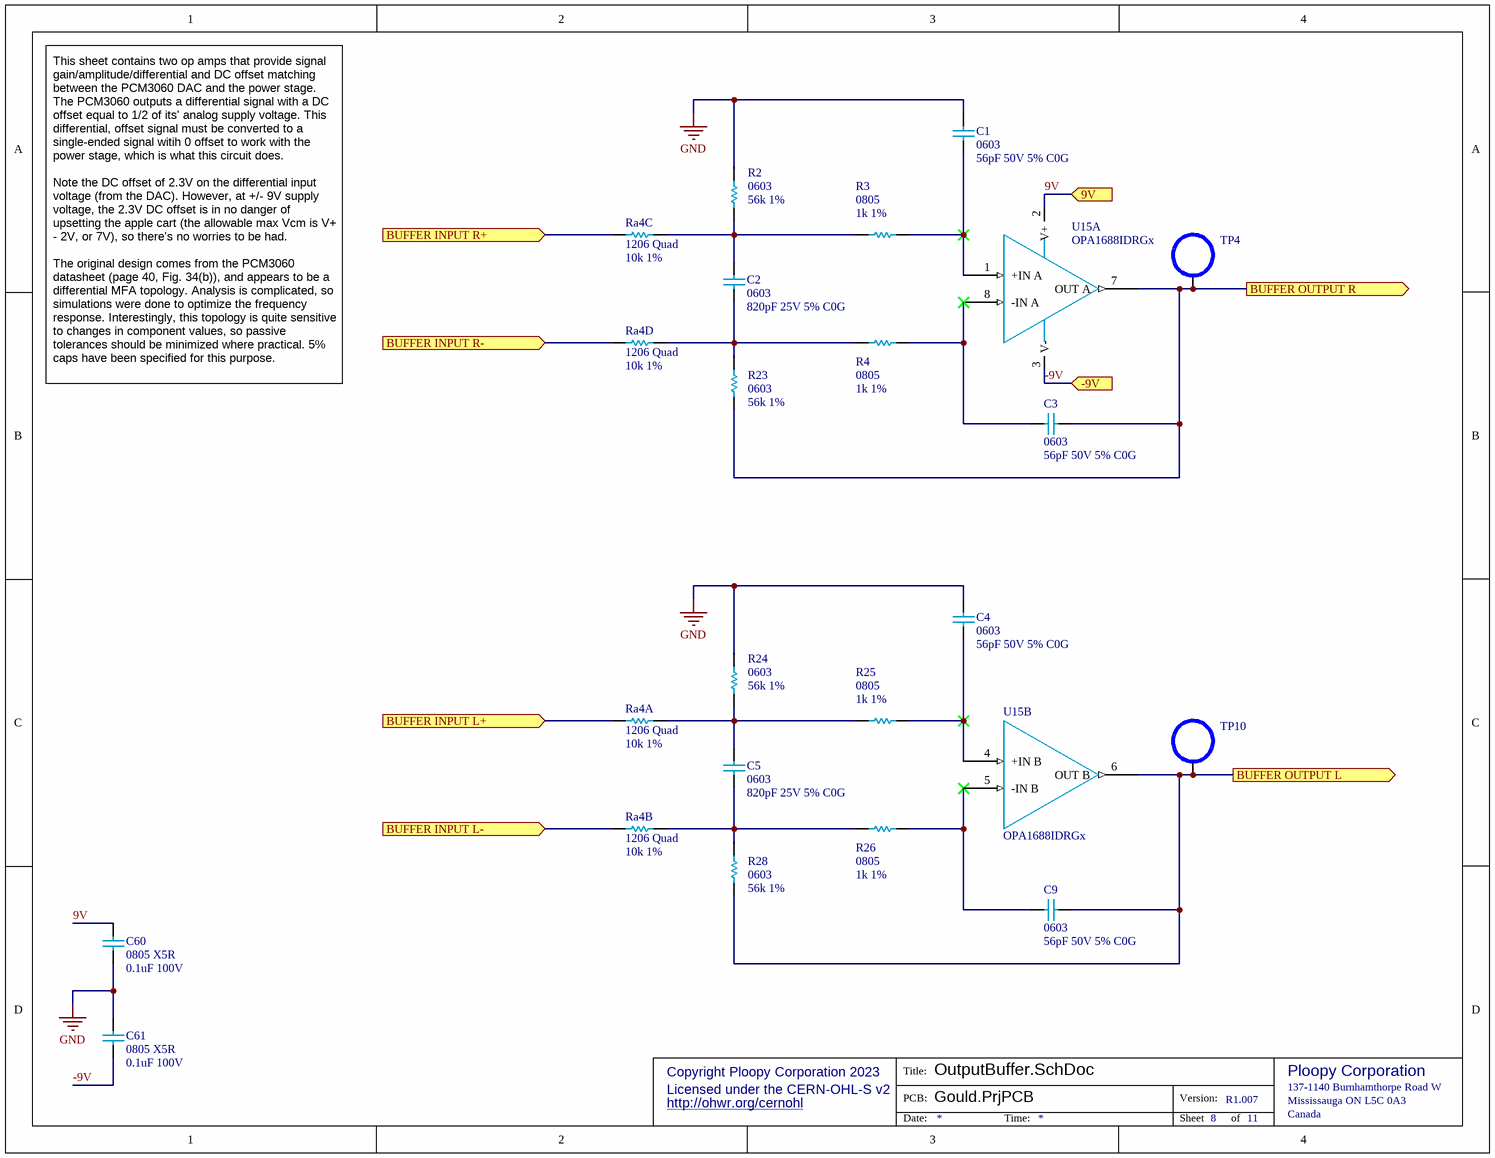
[diagram p9: OutputBuffer.SchDoc]

### Parts
C1  0603  value 56pF 50V 5% C0G  [0603]
C2  0603  value 820pF 25V 5% C0G  [0603]
C3  0603  value 56pF 50V 5% C0G  [0603]
C4  0603  value 56pF 50V 5% C0G  [0603]
C5  0603  value 820pF 25V 5% C0G  [0603]
C9  0603  value 56pF 50V 5% C0G  [0603]
C60  0805 X5R  value 0.1uF 100V  [0805 - TALL]
C61  0805 X5R  value 0.1uF 100V  [0805 - TALL]
R2  0603  value 56k 1%  [0603]
R3  0805  value 1k 1%  [0805]
R4  0805  value 1k 1%  [0805]
R23  0603  value 56k 1%  [0603]
R24  0603  value 56k 1%  [0603]
R25  0805  value 1k 1%  [0805]
R26  0805  value 1k 1%  [0805]
R28  0603  value 56k 1%  [0603]
Ra4  1206 Quad  value 10k 1%  [4x 10k 1% - CAC-80P320X160-8M]  (parts A,B,C,D of 4)
TP4  TestPointHook  [S2751-46R]  (value not drawn)
TP10  TestPointHook  [S2751-46R]  (value not drawn)
U15  OPA1688IDRGx  [OPA1688 - SON50P300X80_HS-9M]  (parts A,B of 2)

### Ports
9V (in), -9V (in), BUFFER INPUT L+ (in), BUFFER INPUT L- (in), BUFFER INPUT R+ (in), BUFFER INPUT R- (in), BUFFER OUTPUT L (out), BUFFER OUTPUT R (out)

### Nets
GND: C1.2 C4.2 C60.1 C61.2 R2.1 R24.1
9V: C60.2 U15.2(V+) ; port 9V
-9V: C61.1 U15.3(V-) ; port -9V
NetC1_1: C1.1 R3.2 U15.1(+IN_A)
NetC2_1: C2.1 R4.1 R23.2 Ra4.5
NetC2_2: C2.2 R2.2 R3.1 Ra4.6
NetC3_1: C3.1 R4.2 U15.8(-IN_A)
NetC3_2: C3.2 R23.1 TP4.1 U15.7(OUT_A) ; port BUFFER OUTPUT R
NetC4_1: C4.1 R25.2 U15.4(+IN_B)
NetC5_1: C5.1 R26.1 R28.2 Ra4.7
NetC5_2: C5.2 R24.2 R25.1 Ra4.8
NetC9_1: C9.1 R26.2 U15.5(-IN_B)
NetC9_2: C9.2 R28.1 TP10.1 U15.6(OUT_B) ; port BUFFER OUTPUT L
NetRa4_1: Ra4.1 ; port BUFFER INPUT L+
NetRa4_2: Ra4.2 ; port BUFFER INPUT L-
NetRa4_3: Ra4.3 ; port BUFFER INPUT R+
NetRa4_4: Ra4.4 ; port BUFFER INPUT R-

### Notes on the sheet
- This sheet contains two op amps that provide signal gain/amplitude/differential and DC offset matching between the PCM3060 DAC and the power stage. The PCM3060 outputs a differential signal with a DC offset equal to 1/2 of its' analog supply voltage. This differential, offset signal must be converted to a single-ended signal witih 0 offset to work with the power stage, which is what this circuit does.
  Note the DC offset of 2.3V on the differential input voltage (from the DAC). However, at +/- 9V supply voltage, the 2.3V DC offset is in no danger of upsetting the apple cart (the allowable max Vcm is V+ - 2V, or 7V), so there's no worries to be had.
  The original design comes from the PCM3060 datasheet (page 40, Fig. 34(b)), and appears to be a differential MFA topology. Analysis is complicated, so simulations were done to optimize the frequency response. Interestingly, this topology is quite sensitive to changes in component values, so passive tolerances should be minimized where practical. 5% caps have been specified for this purpose.
- Copyright Ploopy Corporation 2023
- Licensed under the CERN-OHL-S v2
- http://ohwr.org/cernohl
- Title:
- PCB:
- Version:
- Ploopy Corporation
- Mississauga ON L5C 0A3
- 137-1140 Burnhamthorpe Road W
- Date:
- Time:
- Sheet
- of
- Canada

### Library data of the parts
C1 C3 C4 C9 = Cap 56pF 50V: 0603, 5% C0G or better
C2 C5 = Cap 820pF 25V: 0603, 5% C0G or better
C60 C61 = Cap 0.1uF 100V: 0805, X5R or better; Supplier 1: Digi-Key; Supplier Part Number 1: 1276-6840-2-ND
R2 R23 R24 R28 = Res 56k 1% 0603: Chip resistor
R3 R4 R25 R26 = Res 1k 1% 0805: Chip resistor, 1/8W 100PPM; Supplier 1: Digi-Key; Supplier Part Number 1: RMCF0805FT1K00TR-ND
Ra4 = Quad Res 10k 1% 1206: Chip resistor
TP4 TP10 = TestPointHook: as TP1 on sheet InputConnectors; Supplier 1: Digi-Key; Supplier Part Number 1: 952-2664-6-ND; Supplier 2: Digi-Key; Supplier Part Number 2: A106144DKR-ND; Supplier 3: Arrow; Supplier Part Number 3: z_4zPAhGJpPHHYBcC24zmONEz5elv0VZALWfNkICq0w
U15 = OPA1688IDRGx: as U4 on sheet PowerAmplifier; Supplier 1: Arrow Electronics; Supplier 2: Mouser; Supplier Part Number 2: 595-OPA1688IDRGR; Supplier Part Number 1: OPA1688IDRGR

## Sheet OpAmpNegativeSupply.SchDoc
size Letter; CompanyName: Ploopy Corporation; Organization: Ploopy Corporation; Address1: Suite 226, 137-1140 Burnhamthorpe Road W; Address2: Mississauga; Address3: Ontario; Address4: Canada L5C 0A3; DocumentNumber: 6; Revision: R1.007; SheetNumber: 6; SheetTotal: 11
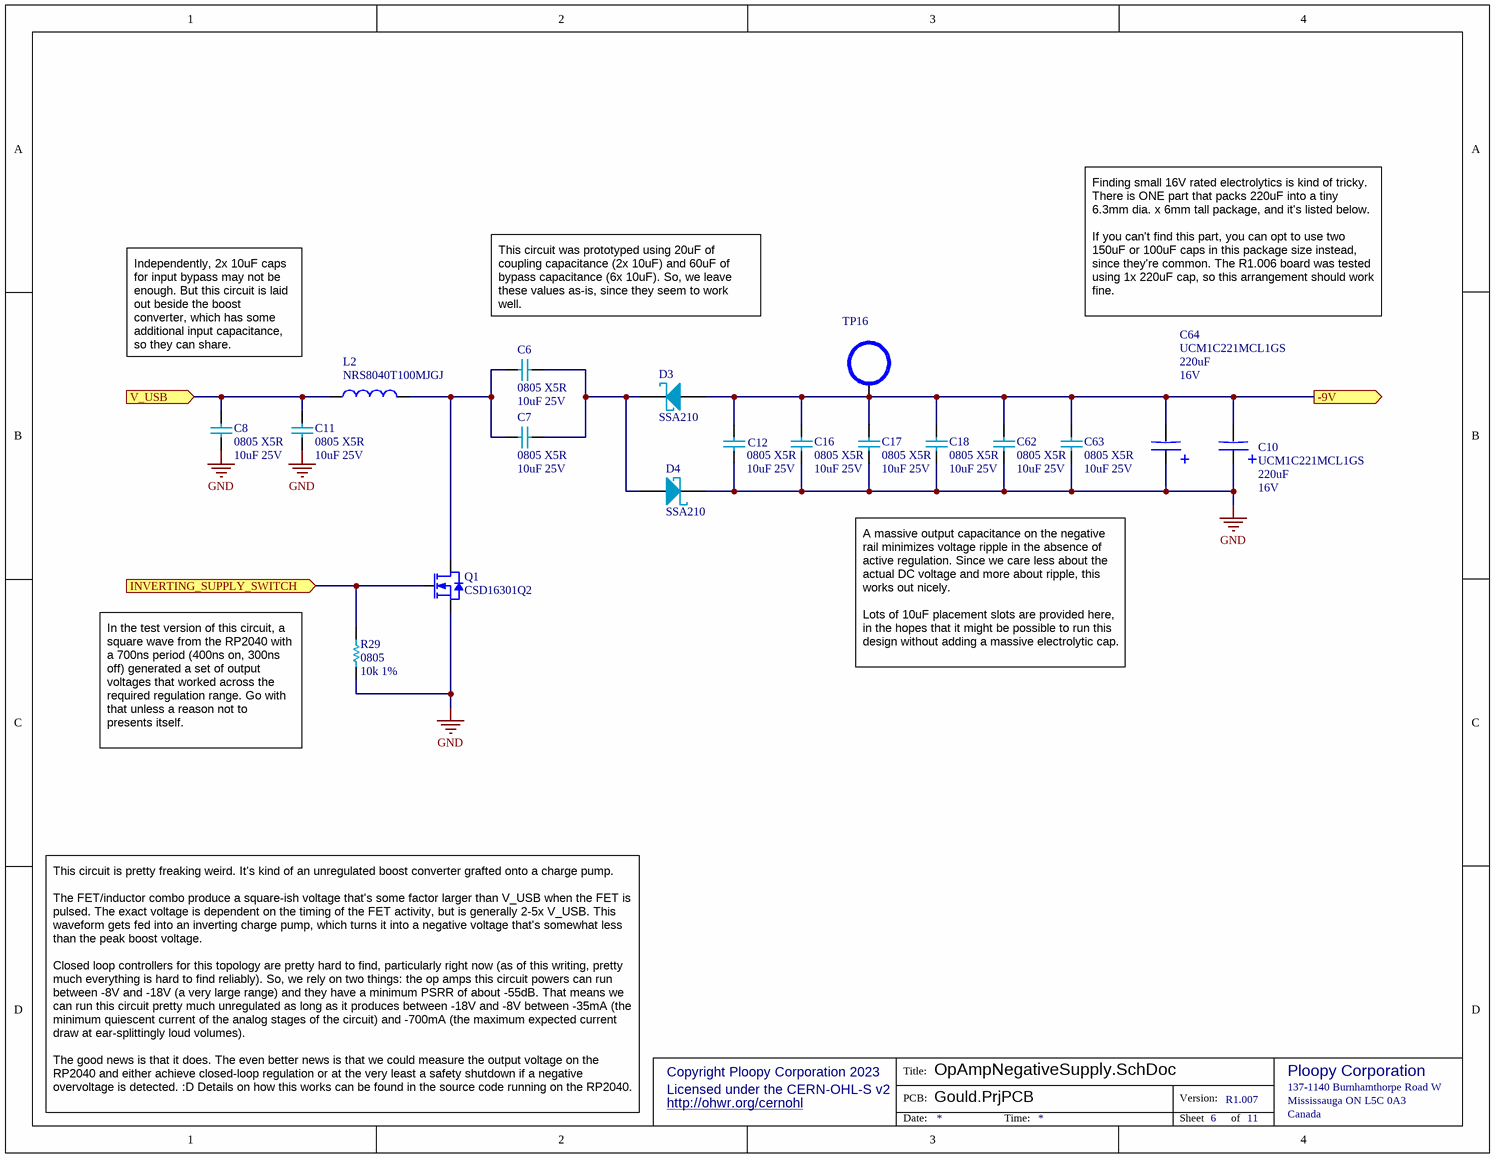
[diagram p10: OpAmpNegativeSupply.SchDoc]

### Parts
C6  0805 X5R  value 10uF 25V  [0805 - TALL]
C7  0805 X5R  value 10uF 25V  [0805 - TALL]
C8  0805 X5R  value 10uF 25V  [0805 - TALL]
C10  UCM1C221MCL1GS  value 220uF  Voltage: 16V  [SMT cap -  6.6mm x 6.6mm land]
C11  0805 X5R  value 10uF 25V  [0805 - TALL]
C12  0805 X5R  value 10uF 25V  [0805 - TALL]
C16  0805 X5R  value 10uF 25V  [0805 - TALL]
C17  0805 X5R  value 10uF 25V  [0805 - TALL]
C18  0805 X5R  value 10uF 25V  [0805 - TALL]
C62  0805 X5R  value 10uF 25V  [0805 - TALL]
C63  0805 X5R  value 10uF 25V  [0805 - TALL]
C64  UCM1C221MCL1GS  value 220uF  Voltage: 16V  [SMT cap -  6.6mm x 6.6mm land]
D3  SSA210  [SSA210 - DO-214AC]
D4  SSA210  [SSA210 - DO-214AC]
L2  NRS8040T100MJGJ  [NRS8040T100MJGJ]
Q1  CSD16301Q2  [CSD16301Q2 - SON65P200X80_HS-7M]
R29  0805  value 10k 1%  [0805]
TP16  TestPointHook  [S2751-46R]  (value not drawn)

### Ports
-9V (out), INVERTING_SUPPLY_SWITCH (in), V_USB (in)

### Nets
GND: C8.1 C10.1 C11.1 C12.2 C16.2 C17.2 C18.2 C62.2 C63.2 C64.1 D4.1(C) Q1.S R29.1
-9V: C10.2 C12.1 C16.1 C17.1 C18.1 C62.1 C63.1 C64.2 D3.2 TP16.1 ; port -9V
NetC6_1: C6.1 C7.1 D3.1(C) D4.2
NetC6_2: C6.2 C7.2 L2.2 Q1.D
NetC8_2: C8.2 C11.2 L2.1 ; port V_USB
NetQ1_G: Q1.G R29.2 ; port INVERTING_SUPPLY_SWITCH

### Notes on the sheet
- Independently, 2x 10uF caps for input bypass may not be enough. But this circuit is laid out beside the boost converter, which has some additional input capacitance, so they can share.
- This circuit was prototyped using 20uF of coupling capacitance (2x 10uF) and 60uF of bypass capacitance (6x 10uF). So, we leave these values as-is, since they seem to work well.
- Finding small 16V rated electrolytics is kind of tricky. There is ONE part that packs 220uF into a tiny 6.3mm dia. x 6mm tall package, and it's listed below.
  If you can't find this part, you can opt to use two 150uF or 100uF caps in this package size instead, since they're common. The R1.006 board was tested using 1x 220uF cap, so this arrangement should work fine.
  EEV107M016S9GAA is a good choice.
- A massive output capacitance on the negative rail minimizes voltage ripple in the absence of active regulation. Since we care less about the actual DC voltage and more about ripple, this works out nicely.
  Lots of 10uF placement slots are provided here, in the hopes that it might be possible to run this design without adding a massive electrolytic cap.
- In the test version of this circuit, a square wave from the RP2040 with a 700ns period (400ns on, 300ns off) generated a set of output voltages that worked across the required regulation range. Go with that unless a reason not to presents itself.
- This circuit is pretty freaking weird. It's kind of an unregulated boost converter grafted onto a charge pump.
  The FET/inductor combo produce a square-ish voltage that's some factor larger than V_USB when the FET is pulsed. The exact voltage is dependent on the timing of the FET activity, but is generally 2-5x V_USB. This waveform gets fed into an inverting charge pump, which turns it into a negative voltage that's somewhat less than the peak boost voltage.
  Closed loop controllers for this topology are pretty hard to find, particularly right now (as of this writing, pretty much everything is hard to find reliably). So, we rely on two things: the op amps this circuit powers can run between -8V and -18V (a very large range) and they have a minimum PSRR of about -55dB. That means we can run this circuit pretty much unregulated as long as it produces between -18V and -8V between -35mA (the minimum quiescent current of the analog stages of the circuit) and -700mA (the maximum expected current draw at ear-splittingly loud volumes).
  The good news is that it does. The even better news is that we could measure the output voltage on the RP2040 and either achieve closed-loop regulation or at the very least a safety shutdown if a negative overvoltage is detected. :D Details on how this works can be found in the source code running on the RP2040.
- Copyright Ploopy Corporation 2023
- Licensed under the CERN-OHL-S v2
- http://ohwr.org/cernohl
- Title:
- PCB:
- Version:
- Ploopy Corporation
- Mississauga ON L5C 0A3
- 137-1140 Burnhamthorpe Road W
- Date:
- Time:
- Sheet
- of
- Canada

### Library data of the parts
C6-C8 C11 C12 C16-C18 C62 C63 = Cap 10uF 25V: 0805, X5R or better; Supplier 1: Mouser; Supplier Part Number 1: 81-GRM21BR61E106KA3L; Supplier 2: Digi-Key; Supplier Part Number 2: 490-5523-1-ND
C10 C64 = UCM1C221MCL1GS: 220uF 16V Electrolytic Capacitor, SMD 6.3mm dia x 6.1mm height; PNP-Nzl: 6; PNP-dx: 0; PNP-X: 8.3; PNP-Y: 1; PNP-Pt: 2; PNP-Thk: 5.4; PNP-Lv: 26; PNP-TS: 70; PNP-Type: CAP; PNP-FeedType: Tape; PNP-TapeWidth: 16; PNP-TapeIndex: 3; PNP-dy: 0; PNP-A: 0; PNP-W: 0; PNP-Level: 1; PNP-Voff: 0; PNP-PlacePriority: 2; PNP-da: 0; Supplier 1: Digi-Key; Supplier Part Number 1: 493-14527-1-ND
D3 D4 = SSA210: 100V 2A Shottky Diode (Rectifier); Supplier 1: Mouser; Supplier Part Number 1: 512-SSA210; Supplier 2: Digi-Key; Supplier Part Number 2: SSA210CT-ND
L2 = NRS8040T100MJGJ: FIXED IND 10UH 3.1A 44.2MOHM SMD
Q1 = CSD16301Q2: 25-V N-Channel Power MOSFET, 20mOhm, 2nC Qg
R29 = Res 10k 1% 0805: Chip resistor; Supplier 1: Digi-Key; Supplier Part Number 1: RMCF0805FT10K0TR-ND
TP16 = TestPointHook: as TP1 on sheet InputConnectors; Supplier 1: Digi-Key; Supplier Part Number 1: 952-2664-6-ND; Supplier 2: Digi-Key; Supplier Part Number 2: A106144DKR-ND; Supplier 3: Arrow; Supplier Part Number 3: z_4zPAhGJpPHHYBcC24zmONEz5elv0VZALWfNkICq0w

## Nets that join several sheets
GND: InputConnectors (9 pins), Mechanical (12 pins), OpAmpSupply (11 pins), OutputConnectors (D2.3 J3.1 J3.4 TP13.1), POL (C26_POL.1 C27_POL.1 C30_POL.2 C31_POL.2), POR (C26_POR.1 C27_POR.1 C30_POR.2 C31_POR.2), MCU (40 pins), CODEC (17 pins), Regulators (9 pins), OutputBuffer (6 pins), OpAmpNegativeSupply (13 pins)
3V3: MCU (21 pins), CODEC (5 pins), Regulators (C55.2 C56.2 U3.5)
4V6: CODEC (C36.2 C37.2 U10.24), Regulators (5 pins)
9V: OpAmpSupply (9 pins), POL (6 pins), POR (6 pins), OutputBuffer (C60.2 U15.2)
-9V: POL (6 pins), POR (6 pins), MCU (R27.1), OutputBuffer (C61.1 U15.3), OpAmpNegativeSupply (10 pins)
NetC3_2: POR (8 pins), OutputBuffer (C3.2 R23.1 TP4.1 U15.7)
NetC8_2: InputConnectors (FB3.2), OpAmpSupply (6 pins), Regulators (6 pins), OpAmpNegativeSupply (C8.2 C11.2 L2.1)
NetC9_2: POL (8 pins), OutputBuffer (C9.2 R28.1 TP10.1 U15.6)
NetD2_1: OutputConnectors (D2.1 J3.3 TP14.1), POR (8 pins)
NetD2_2: OutputConnectors (D2.2 J3.2 TP15.1), POL (8 pins)
NetFB4_2: InputConnectors (FB4.2), MCU (R12.2)
NetFB5_2: InputConnectors (FB5.2), MCU (R11.2)
NetQ1_G: MCU (U12.28), OpAmpNegativeSupply (Q1.G R29.2)
NetR1_2: OpAmpSupply (R1.2 U9.4), MCU (U12.34)
NetRa1_3: MCU (U12.2), CODEC (Ra1.3 U10.2)
NetRa1_4: MCU (U12.3), CODEC (Ra1.4 U10.1)
NetRa4_1: CODEC (U10.20), OutputBuffer (Ra4.1)
NetRa4_2: CODEC (U10.19), OutputBuffer (Ra4.2)
NetRa4_3: CODEC (U10.18), OutputBuffer (Ra4.3)
NetRa4_4: CODEC (U10.17), OutputBuffer (Ra4.4)
NetU10_9: MCU (U12.30), CODEC (U10.9)
NetU10_10: MCU (U12.11), CODEC (U10.10)
NetU10_11: MCU (U12.12), CODEC (U10.11)
NetU10_12: MCU (U12.15), CODEC (U10.12)
NetU10_15: MCU (U12.17), CODEC (U10.15)